# Altium project RK3128_BETA_V03_20151231.PrjPcb (part 2 of 3)

## Sheet Option_PMIC_RK818.SchDoc
size 420 x 297 mm
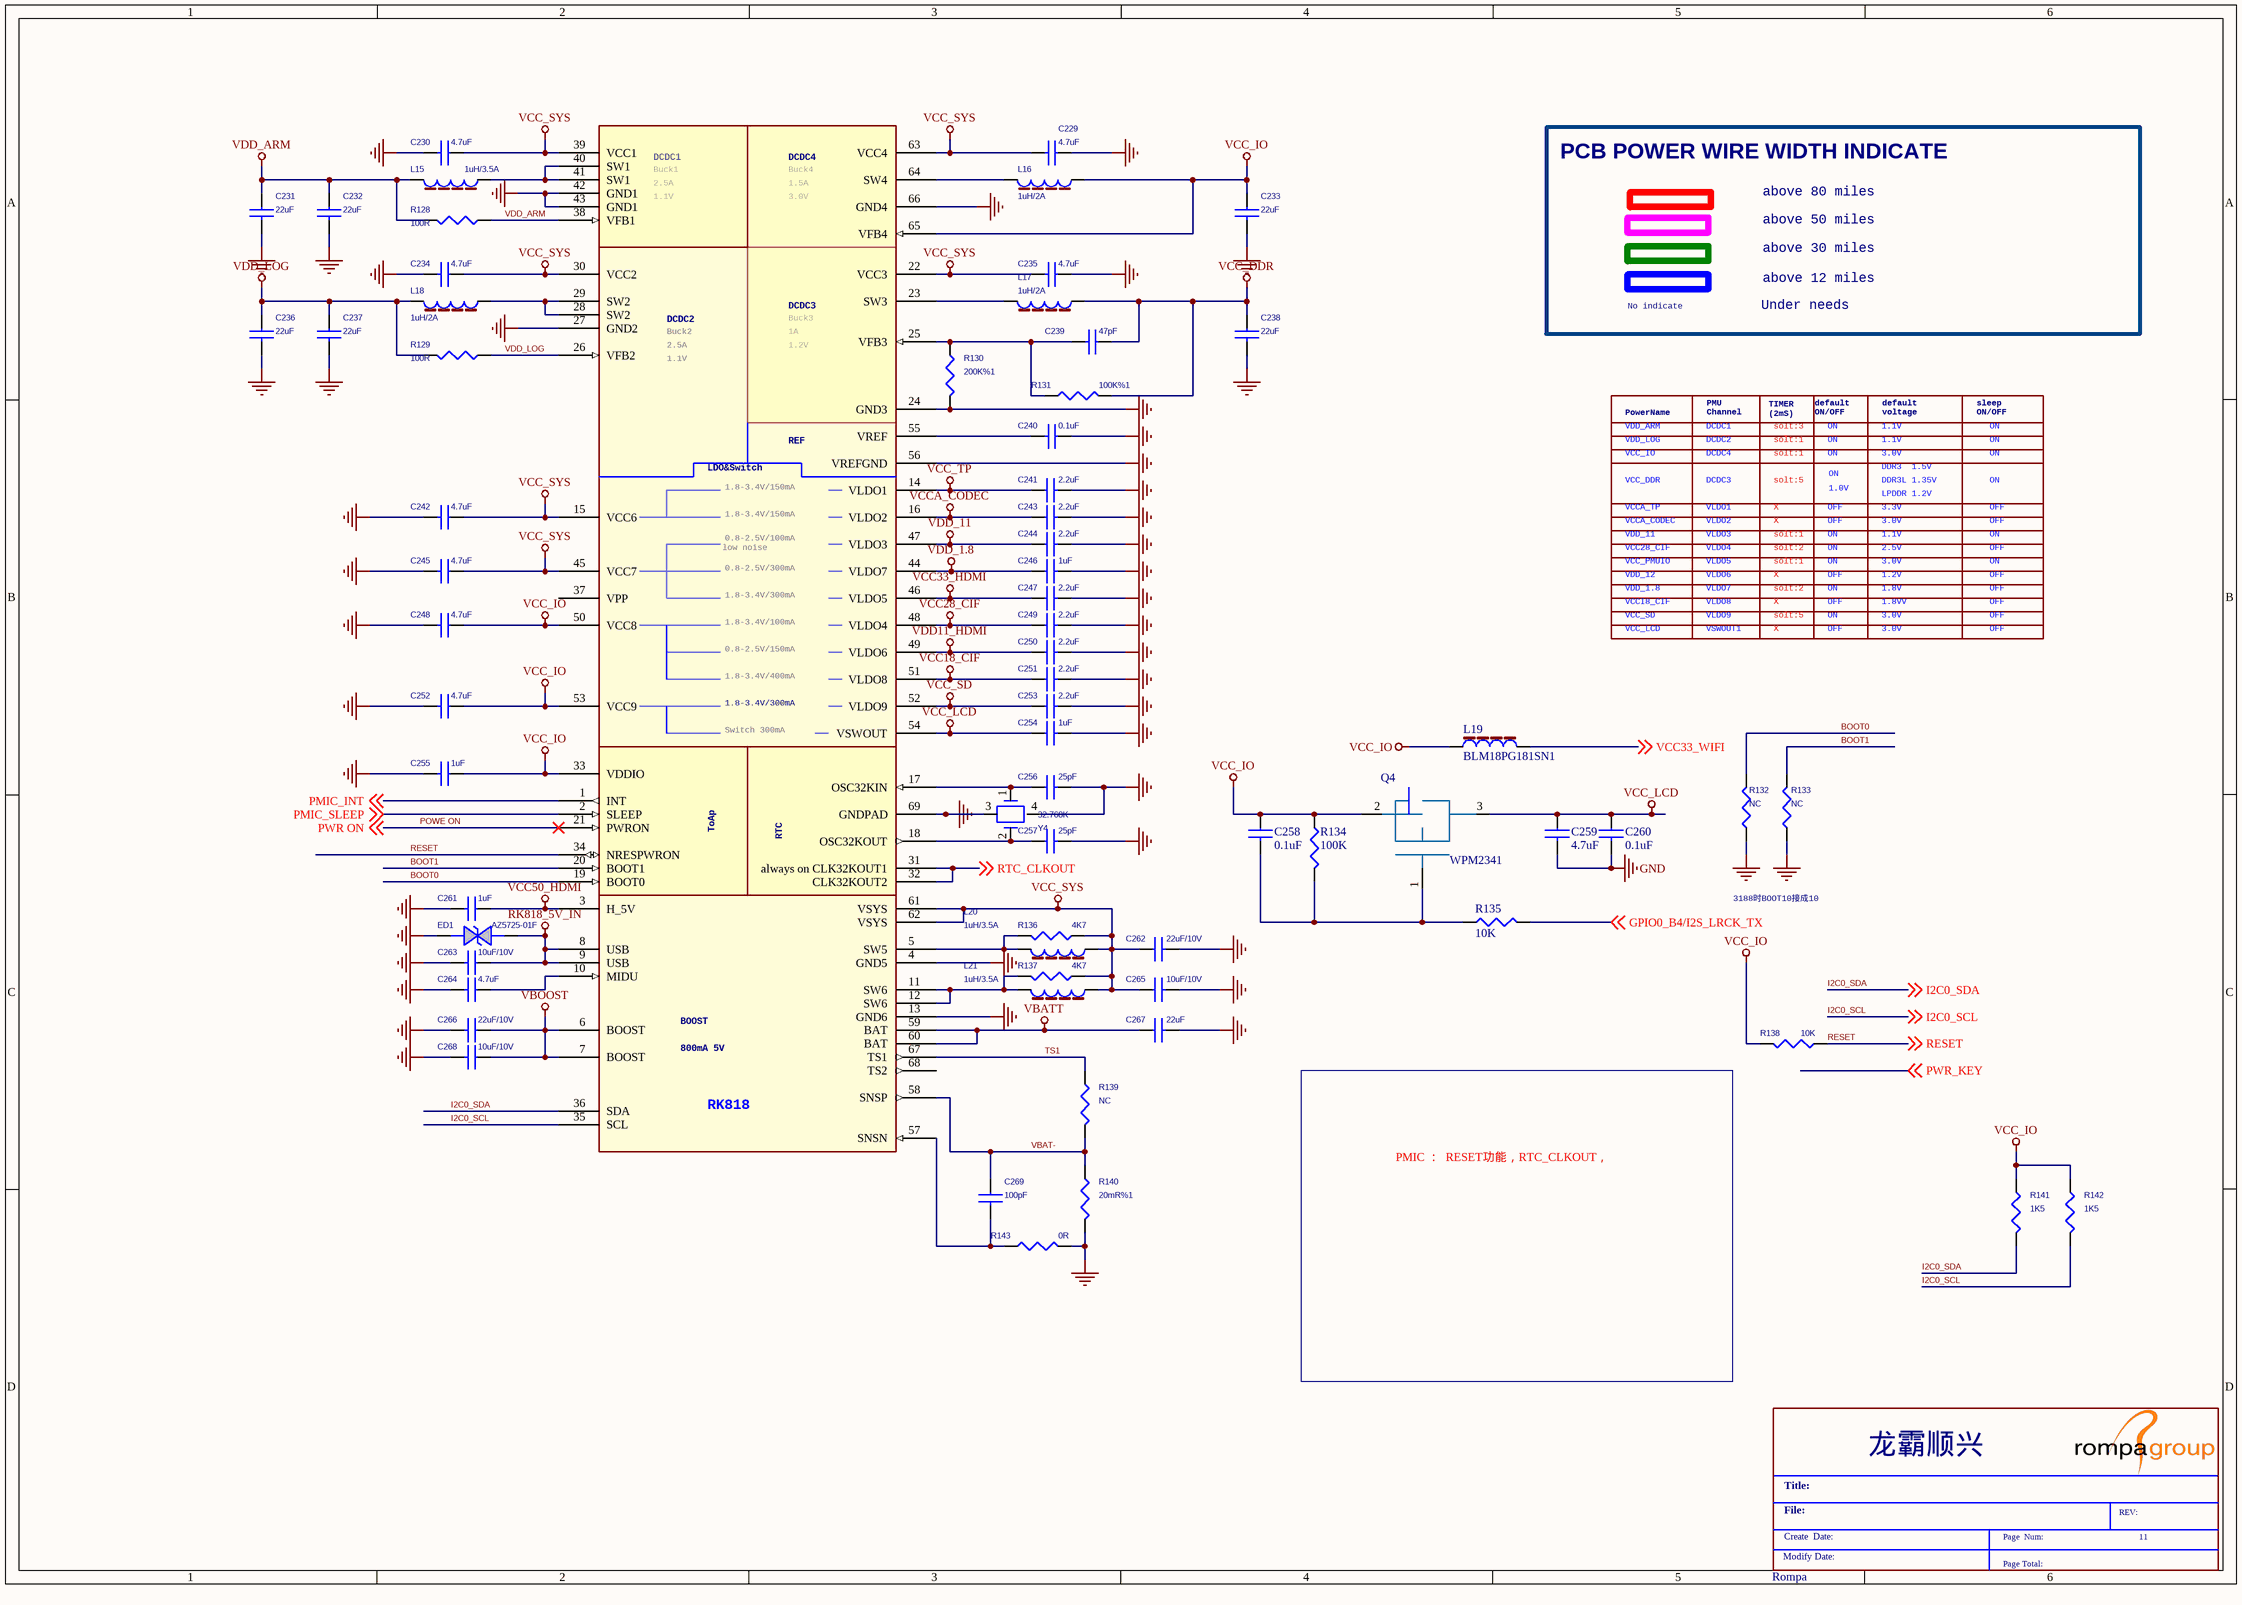
[diagram p15: Option_PMIC_RK818.SchDoc]

### Parts
(Parts that share a designator on the sheet are numbered #1, #2 ... from top to bottom, then left to right.)
*#15  Rompa  Schematic Page Number: 11  (graphical)
C229  4.7uF  [C0603]
C230  4.7uF  [C0603]
C231  22uF  [C0805]
C232  22uF  [C0805]
C233  22uF  [C0805]
C234  4.7uF  [C0603]
C235  4.7uF  [C0603]
C236  22uF  [C0805]
C237  22uF  [C0805]
C238  22uF  [C0805]
C239  47pF  [C0402]
C240  0.1uF  [C0402]
C241  2.2uF  [C0402]
C242  4.7uF  [C0603]
C243  2.2uF  [C0402]
C244  2.2uF  [C0402]
C245  4.7uF  [C0603]
C246  1uF  [C0402]
C247  2.2uF  [C0402]
C248  4.7uF  [C0603]
C249  2.2uF  [C0402]
C250  2.2uF  [C0402]
C251  2.2uF  [C0402]
C252  4.7uF  [C0603]
C253  2.2uF  [C0402]
C254  1uF  [C0402]
C255  1uF  [C0402]
C256  25pF  [C0402]
C257  25pF  [C0402]
C258  0.1uF  [C0402]
C259  4.7uF  [C0402]
C260  0.1uF  [C0402]
C261  1uF  [C0402]
C262  22uF/10V  [C1206]
C263  10uF/10V  [C0805]
C264  4.7uF  [C0603]
C265  10uF/10V  [C0805]
C266  22uF/10V  [C1206]
C267  22uF  [C0805]
C268  10uF/10V  [C0805]
C269  100pF  [C0402]
ED1  AZ5725-01F  [E0402]
L15  1uH/3.5A  [IND-4X4]
L16  1uH/2A  [IND-3X3]
L17  1uH/2A  [IND-3X3]
L18  1uH/2A  [IND-3X3]
L19  BLM18PG181SN1  [L0603]
L20  1uH/3.5A  [IND-4X4]
L21  1uH/3.5A  [IND-4X4]
Q4  WPM2341  [SOT23]
R128  100R  [R0402]
R129  100R  [R0402]
R130  200K%1  [R0402]
R131  100K%1  [R0402]
R132  NC  [R0402]
R133  NC  [R0402]
R134  100K  [R0402]
R135  10K  [R0402]
R136  4K7  [R0402]
R137  4K7  [R0402]
R138  10K  [R0402]
R139  NC  [R0402]
R140  20mR%1  [R1210]
R141  1K5  [R0402]
R142  1K5  [R0402]
R143  0R  [R0402]
U19  RK818  [QFN68]  (value not drawn)
Y4  32.768K  [CRY_MC146]

### Nets
GND: C229.1 C230.2 C231.2 C232.2 C233.2 C234.2 C235.1 C236.2 C237.2 C238.2 C240.1 C241.2 C242.2 C243.2 C244.2 C245.2 C246.2 C247.2 C248.2 C249.2 C250.2 C251.2 C252.2 C253.2 C254.2 C255.2 C256.2 C257.2 C259.2 C260.2 C261.2 C262.2 C263.2 C264.2 C265.2 C266.2 C267.2 C268.2 ED1.1 R130.1 R132.2 R133.2 R140.2 R143.2 U19.4(GND5) U19.13(GND6) U19.24(GND3) U19.27(GND2) U19.42(GND1) U19.43(GND1) U19.56(VREFGND) U19.66(GND4) U19.69(GNDPAD) Y4.3 Y4.4
RK818_5V_IN: C263.1 ED1.2 U19.8(USB) U19.9(USB)
VBATT: C267.1 U19.59(BAT) U19.60(BAT)
VBOOST: C266.1 C268.1 U19.6(BOOST) U19.7(BOOST)
VCC18_CIF: C251.1 U19.51(VLDO8)
VCC28_CIF: C249.1 U19.48(VLDO4)
VCC33_HDMI: C247.1 U19.46(VLDO5)
VCC50_HDMI: C261.1 U19.3(H_5V)
VCC_DDR: C238.1 C239.1 L17.2 R131.1
VCC_IO: C233.1 C248.1 C252.1 C255.1 C258.1 L16.2 L19.1 R134.1 R138.1 R141.1 R142.1 U19.33(VDDIO) U19.50(VCC8) U19.53(VCC9) U19.65(VFB4)
VCC_LCD: C254.1 C259.1 C260.1 U19.54(VSWOUT)
VCC_SD: C253.1 U19.52(VLDO9)
VCC_SYS: C229.2 C230.1 C234.1 C235.2 C242.1 C245.1 C262.1 C265.1 L20.2 L21.2 R136.1 R137.1 U19.15(VCC6) U19.22(VCC3) U19.30(VCC2) U19.39(VCC1) U19.45(VCC7) U19.61(VSYS) U19.62(VSYS) U19.63(VCC4)
VCC_TP: C241.1 U19.14(VLDO1)
VCCA_CODEC: C243.1 U19.16(VLDO2)
VDD11_HDMI: C250.1 U19.49(VLDO6)
VDD_1.8: C246.1 U19.44(VLDO7)
VDD_11: C244.1 U19.47(VLDO3)
VDD_ARM: C231.1 C232.1 L15.1 R128.1 R128.2 U19.38(VFB1)
VDD_LOG: C236.1 C237.1 L18.1 R129.1 R129.2 U19.26(VFB2)
BOOT0: R132.1 U19.19(BOOT0)
BOOT1: R133.1 U19.20(BOOT1)
GPIO0_B4/I2S_LRCK_TX: R135.2 ; off-sheet GPIO0_B4/I2S_LRCK_TX
I2C0_SCL: R142.2 U19.35(SCL) ; off-sheet I2C0_SCL
I2C0_SDA: R141.2 U19.36(SDA) ; off-sheet I2C0_SDA
PMIC_INT: U19.1(INT) ; off-sheet PMIC_INT
PMIC_SLEEP: U19.2(SLEEP) ; off-sheet PMIC_SLEEP
POWE ON: U19.21(PWRON) ; off-sheet PWR ON  [also labelled PWR ON]
RESET: R138.2 U19.34(NRESPWRON) ; off-sheet RESET
RTC_CLKOUT: U19.31(always_on_CLK32KOUT1) U19.32(CLK32KOUT2) ; off-sheet RTC_CLKOUT
TS1: R139.1 U19.67(TS1)
VBAT-: C269.1 R139.2 R140.1 U19.58(SNSP)
VCC33_WIFI: L19.2 ; off-sheet VCC33_WIFI  [project net VCCIO_WL]
NetC239_2: C239.2 R130.2 R131.2 U19.25(VFB3)
NetC240_2: C240.2 U19.55(VREF)
NetC256_1: C256.1 U19.17(OSC32KIN) Y4.1
NetC257_1: C257.1 U19.18(OSC32KOUT) Y4.2
NetC258_2: C258.2 Q4.1 R134.2 R135.1
NetC264_1: C264.1 U19.10(MIDU)
NetC269_2: C269.2 R143.1 U19.57(SNSN)
NetL15_2: L15.2 U19.40(SW1) U19.41(SW1)
NetL16_1: L16.1 U19.64(SW4)
NetL17_1: L17.1 U19.23(SW3)
NetL18_2: L18.2 U19.28(SW2) U19.29(SW2)
NetL20_1: L20.1 R136.2 U19.5(SW5)
NetL21_1: L21.1 R137.2 U19.11(SW6) U19.12(SW6)

Not connected (* = marked no-connect by the designer): Q4 2 3; U19 37(VPP) 68(TS2)

### Notes on the sheet
- PCB POWER WIRE WIDTH INDICATE
- above 30 miles
- above 50 miles
- above 80 miles
- No indicate
- Under needs
- above 12 miles
- VDD_ARM
- VCC_IO
- VDD_LOG
- PowerName
- PMU
  Channel
- DCDC4
- DCDC1
- DCDC2
- TIMER
  (2mS)
- solt:1
- solt:3
- default
  ON/OFF
- ON
- 1.1V
- default
  voltage
- 3.0V
- sleep
  ON/OFF
- VCC_DDR
- VCCA_TP
- VCCA_CODEC
- DCDC3
- VLDO2
- VLDO1
- solt:5
- X
- OFF
- 1.0V
- 3.3V
- DDR3  1.5V
- LPDDR 1.2V
- DDR3L 1.35V
- VDD_11
- VCC_PMUIO
- VCC28_CIF
- VDD_12
- VDD_1.8
- VLDO4
- VLDO5
- VLDO3
- VLDO7
- VLDO6
- solt:2
- 1.2V
- 1.8V
- 2.5V
- VCC_SD
- VCC_LCD
- VCCI8_CIF
- VSWOUT1
- VLDO8
- VLDO9
- 1.8VV
- 3188时BOOT10接成10
- (near U19) RK818
- PMIC ：  RESET功能，RTC_CLKOUT，
- (in symbol RK818_1) DCDC1; DCDC4; Buck1; Buck4; 2.5A; 1.5A; 1.1V; 3.0V; DCDC3; Buck3; DCDC2; Buck2; 1A; 1.2V; REF; LDO&Switch; 1.8-3.4V/150mA; 0.8-2.5V/100mA; low noise; 0.8-2.5V/300mA; 1.8-3.4V/300mA; 1.8-3.4V/100mA; 0.8-2.5V/150mA; 1.8-3.4V/400mA; Switch 300mA; ToAp; RTC; 800mA 5V
- (in symbol Rompa) 龙霸顺兴; Title:; File:; REV:; Create  Date:; Page  Num:; Modify Date:; Page Total:

### Library data of the parts
C229-C257 C261-C269 = CAP NP_4
C258-C260 = CAP NP
ED1 = DIODE BI-DIR TRIG: ESD
L15-L18 L20 L21 = INDUCTOR_2: ROOM: USB+5V
L19 = INDUCTOR_2
R128-R133 R136-R138 = RESISTOR_1: RES,thick film,47KOhm,+/-5%,1/16W,SMD0402
R134 R135 = RESISTOR
R139 R143 = RESISTOR_1: 贴片电阻; ROOM: USB+5V; MARK: 2K
R140 = RESISTOR_1: 贴片电阻; MARK: 2K; ROOM: USB+5V
R141 R142 = RES 1B: ROHS CHIP RES 4.7K 1/16W 5%
U19 = RK818_1
Y4 = CRYSTAL_0: Crystal,32.768KHz,+/-30ppm,12pF,MC146,-10°C ~ +60   °C; Part Type: 晶体类\无源晶体

## Sheet 11_RK3128_CODEC_HDMI_DAC.SchDoc
size 420 x 297 mm
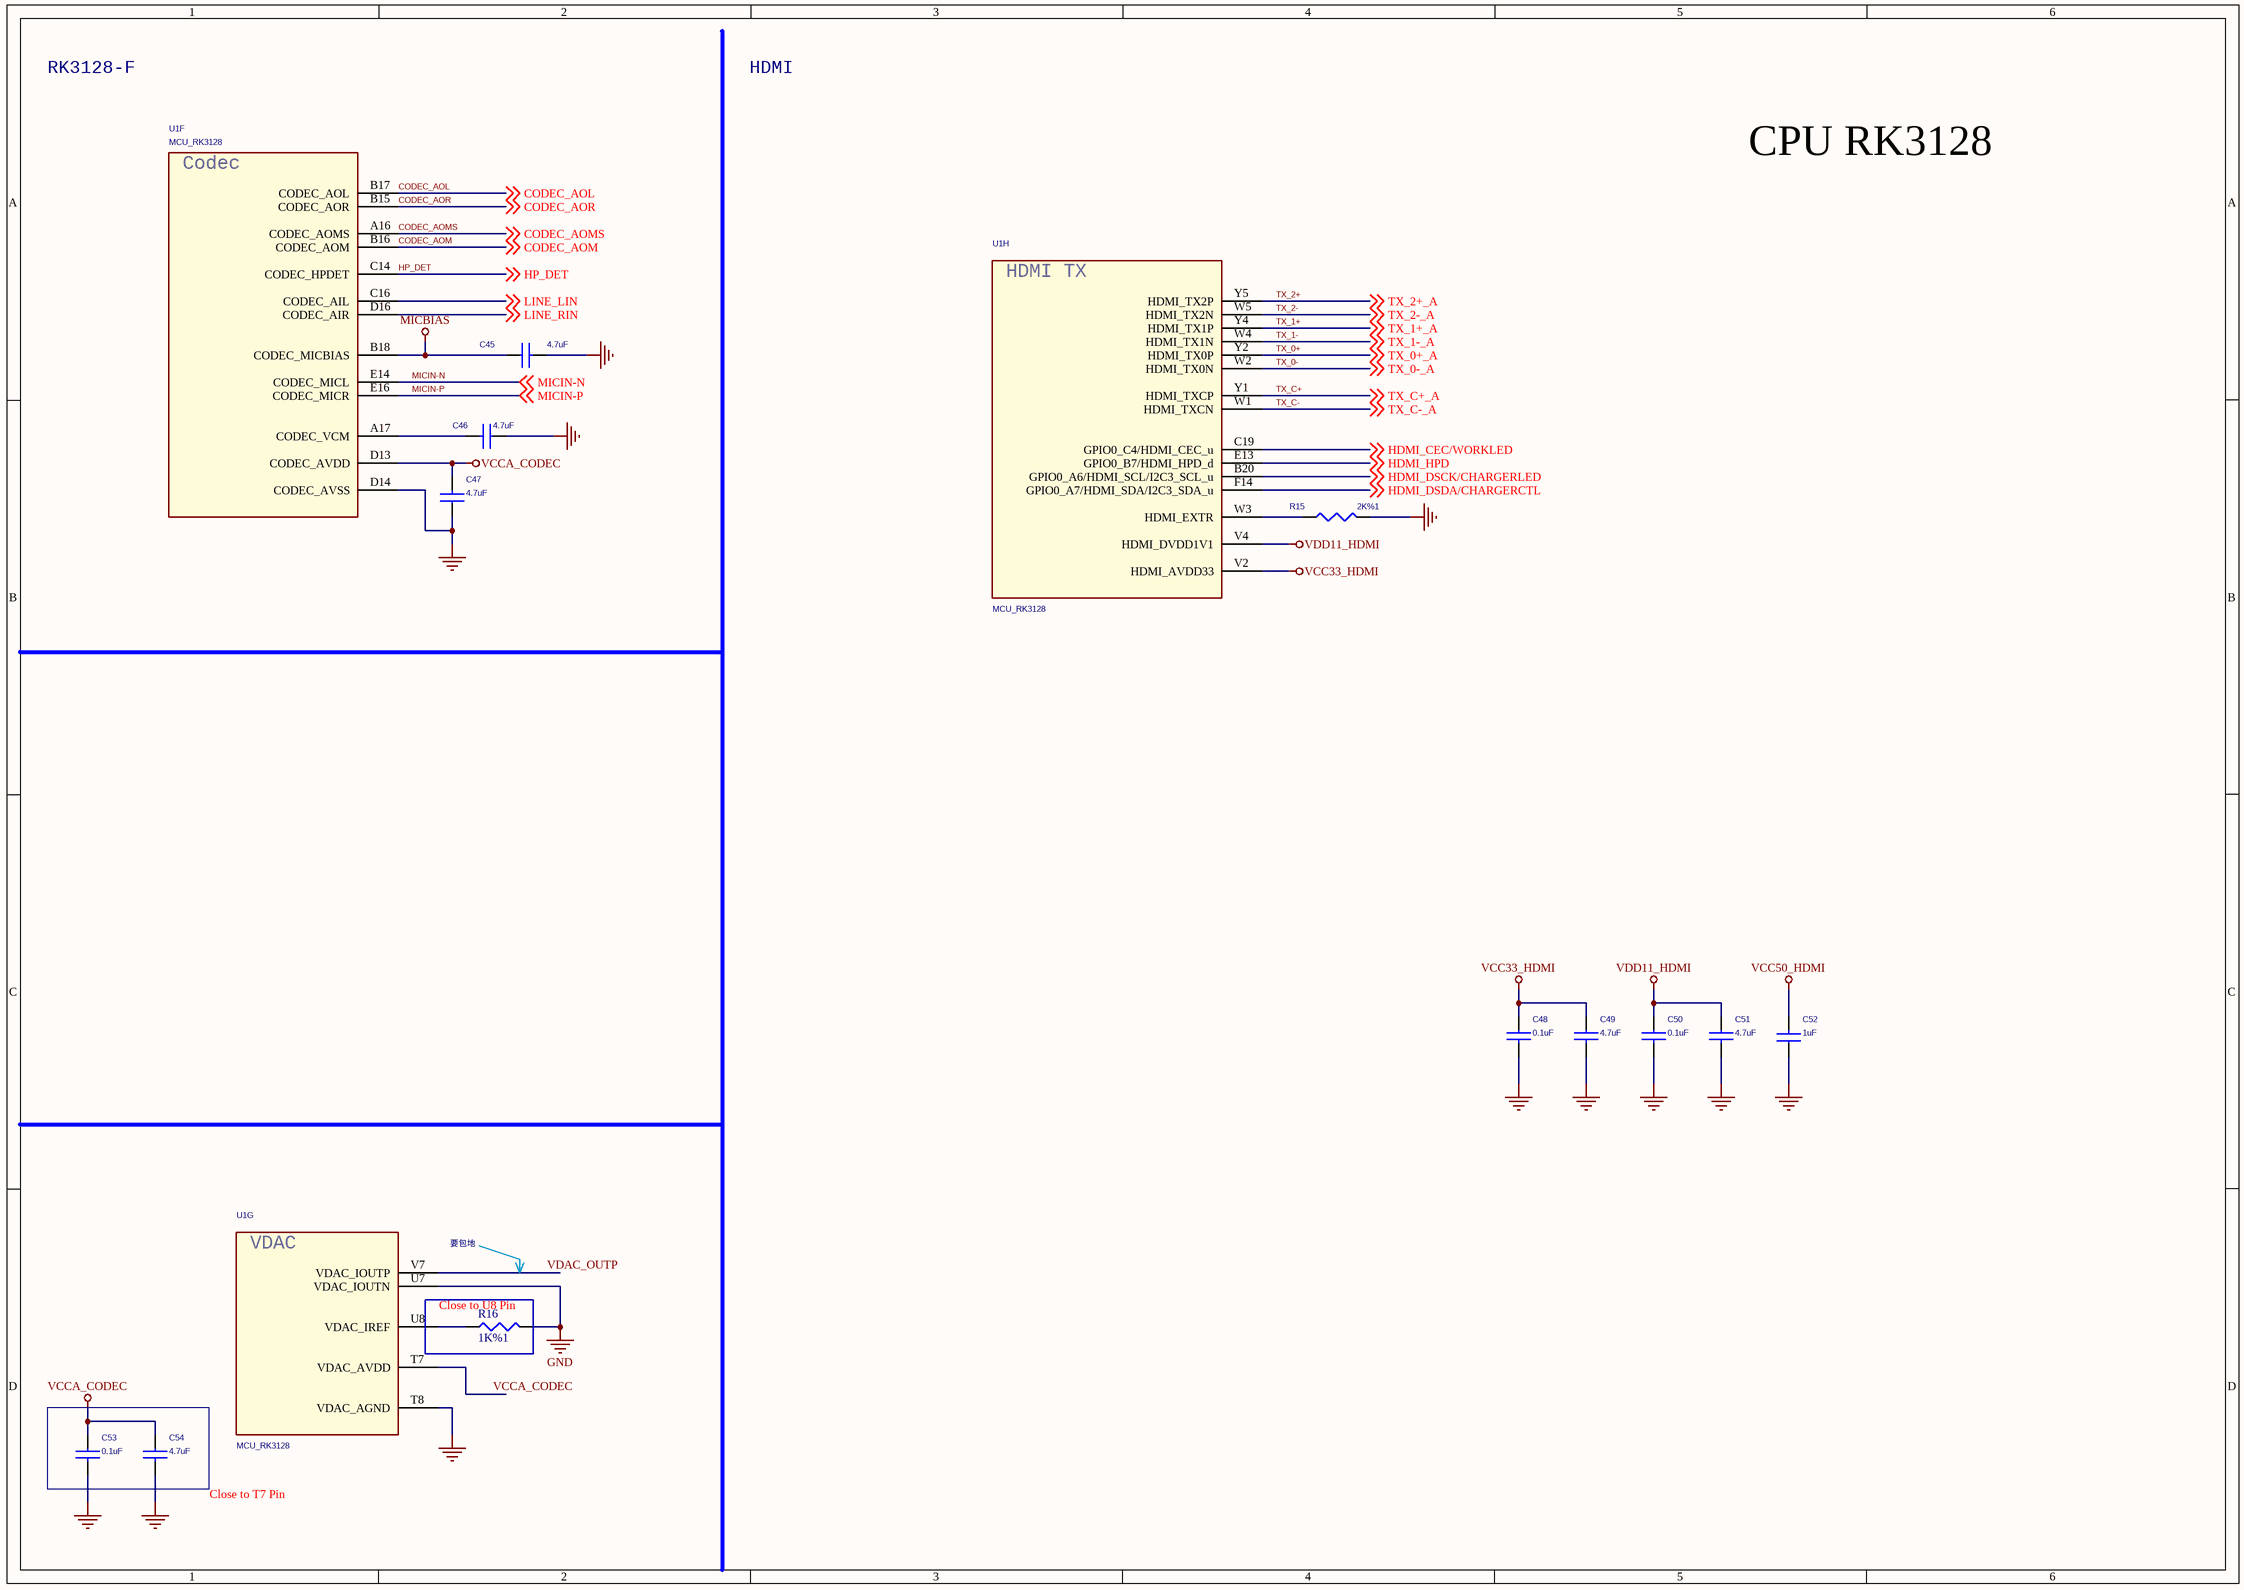
[diagram p16: 11_RK3128_CODEC_HDMI_DAC.SchDoc]

### Parts
C45  4.7uF  [C0603]
C46  4.7uF  [C0603]
C47  4.7uF  [C0603]
C48  0.1uF  [C0402]
C49  4.7uF  [C0603]
C50  0.1uF  [C0402]
C51  4.7uF  [C0603]
C52  1uF  [C0402]
C53  0.1uF  [C0402]
C54  4.7uF  [C0603]
R15  2K%1  [R0402]
R16  1K%1  [R0402]
U1  MCU_RK3128  [BGA316-14X14-0.65]  (parts F,G,H of 12)

### Blocks framed on the sheet
Close to U8 Pin: R16

### Nets
GND: C45.2 C46.1 C47.1 C48.2 C49.2 C50.2 C51.2 C52.1 C53.2 C54.2 R15.1 R16.2 U1.D14(CODEC_AVSS) U1.T8(VDAC_AGND) U1.U7(VDAC_IOUTN)
MICBIAS: C45.1 U1.B18(CODEC_MICBIAS)
VCC33_HDMI: C48.1 C49.1 U1.V2(HDMI_AVDD33)
VCC50_HDMI: C52.2
VCCA_CODEC: C47.2 C53.1 C54.1 U1.D13(CODEC_AVDD) U1.T7(VDAC_AVDD)
VDD11_HDMI: C50.1 C51.1 U1.V4(HDMI_DVDD1V1)
CODEC_AOL: U1.B17(CODEC_AOL) ; off-sheet CODEC_AOL
CODEC_AOM: U1.B16(CODEC_AOM) ; off-sheet CODEC_AOM
CODEC_AOMS: U1.A16(CODEC_AOMS) ; off-sheet CODEC_AOMS
CODEC_AOR: U1.B15(CODEC_AOR) ; off-sheet CODEC_AOR
HDMI_CEC/WORKLED: U1.C19(GPIO0_C4/HDMI_CEC_u) ; off-sheet HDMI_CEC/WORKLED
HDMI_DSCK/CHARGERLED: U1.B20(GPIO0_A6/HDMI_SCL/I2C3_SCL_u) ; off-sheet HDMI_DSCK/CHARGERLED
HDMI_DSDA/CHARGERCTL: U1.F14(GPIO0_A7/HDMI_SDA/I2C3_SDA_u) ; off-sheet HDMI_DSDA/CHARGERCTL
HDMI_HPD: U1.E13(GPIO0_B7/HDMI_HPD_d) ; off-sheet HDMI_HPD
HP_DET: U1.C14(CODEC_HPDET) ; off-sheet HP_DET
LINE_LIN: U1.C16(CODEC_AIL) ; off-sheet LINE_LIN
LINE_RIN: U1.D16(CODEC_AIR) ; off-sheet LINE_RIN
MICIN-N: U1.E14(CODEC_MICL) ; off-sheet MICIN-N
MICIN-P: U1.E16(CODEC_MICR) ; off-sheet MICIN-P
TX_0+: U1.Y2(HDMI_TX0P) ; off-sheet TX_0+_A  [also labelled TX_0+_A]
TX_0-: U1.W2(HDMI_TX0N) ; off-sheet TX_0-_A  [also labelled TX_0-_A]
TX_1+: U1.Y4(HDMI_TX1P) ; off-sheet TX_1+_A  [also labelled TX_1+_A]
TX_1-: U1.W4(HDMI_TX1N) ; off-sheet TX_1-_A  [also labelled TX_1-_A]
TX_2+: U1.Y5(HDMI_TX2P) ; off-sheet TX_2+_A  [also labelled TX_2+_A]
TX_2-: U1.W5(HDMI_TX2N) ; off-sheet TX_2-_A  [also labelled TX_2-_A]
TX_C+: U1.Y1(HDMI_TXCP) ; off-sheet TX_C+_A  [also labelled TX_C+_A]
TX_C-: U1.W1(HDMI_TXCN) ; off-sheet TX_C-_A  [also labelled TX_C-_A]
VDAC_OUTP: U1.V7(VDAC_IOUTP)
NetC46_2: C46.2 U1.A17(CODEC_VCM)
NetR15_2: R15.2 U1.W3(HDMI_EXTR)
NetR16_1: R16.1 U1.U8(VDAC_IREF)

### Notes on the sheet
- RK3128-F
- HDMI
- CPU RK3128
- 要包地
- Close to T7 Pin
- (in symbol MCU_RK3128, part F) Codec
- (in symbol MCU_RK3128, part G) VDAC
- (in symbol MCU_RK3128, part H) HDMI TX

### Library data of the parts
C45 C48-C51 C53 C54 = CAP NP
C46 = CAP NP: CAP,MLCC,10uF,+/-10%,X5R,16V,SMD0805
C47 = CAP NP: RoHS CHIP CAP 0.1uF +10/-10% X7R
C52 = CAP NP: RoHS CHIP CAP 1uF +10/-10% X5R
R15 = RESISTOR_0: RES,thick film,3.5KOhm,+/-5%,1/16W,SMD0402
R16 = RESISTOR: 1K %1 R0402

## Sheet 10_RK3128_misc.SchDoc
size 297 x 209 mm
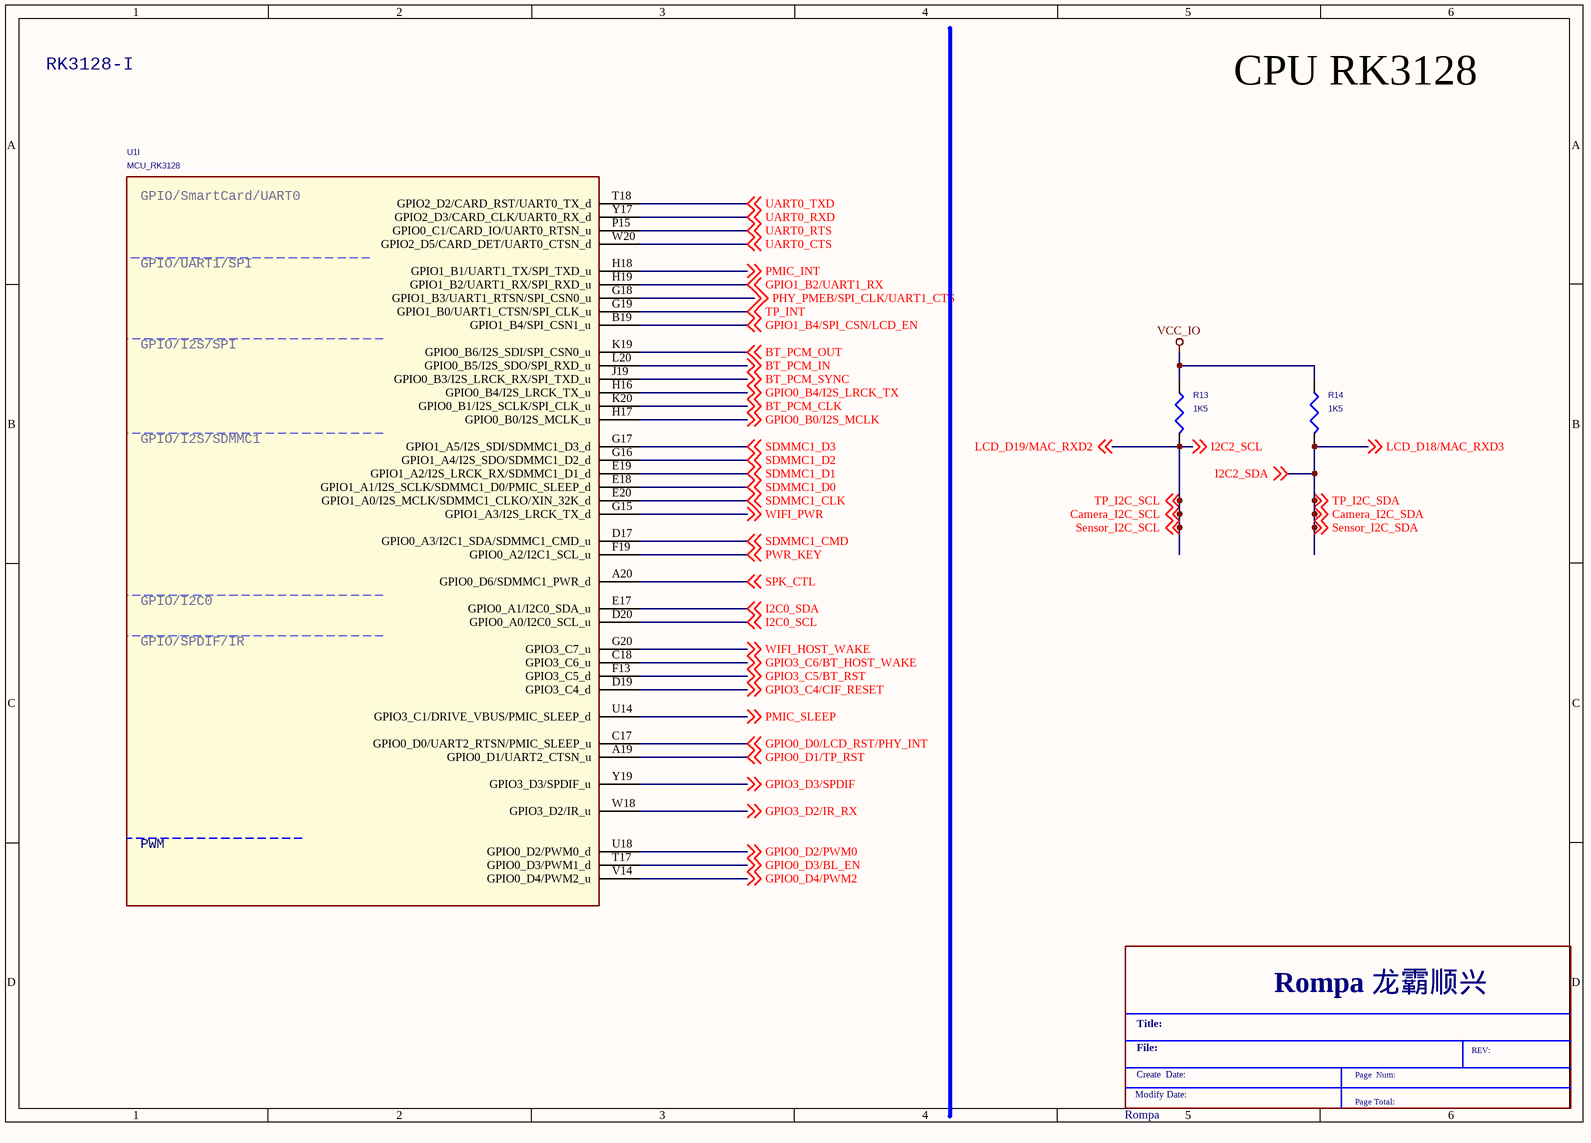
[diagram p17: 10_RK3128_misc.SchDoc]

### Parts
(Parts that share a designator on the sheet are numbered #1, #2 ... from top to bottom, then left to right.)
*#16  Rompa  (graphical)
R13  1K5  [R0402]
R14  1K5  [R0402]
U1  MCU_RK3128  [BGA316-14X14-0.65]  (part I of 12)

### Nets
VCC_IO: R13.1 R14.1
BT_PCM_CLK: U1.K20(GPIO0_B1/I2S_SCLK/SPI_CLK_u) ; off-sheet BT_PCM_CLK
BT_PCM_IN: U1.L20(GPIO0_B5/I2S_SDO/SPI_RXD_u) ; off-sheet BT_PCM_IN
BT_PCM_OUT: U1.K19(GPIO0_B6/I2S_SDI/SPI_CSN0_u) ; off-sheet BT_PCM_OUT
BT_PCM_SYNC: U1.J19(GPIO0_B3/I2S_LRCK_RX/SPI_TXD_u) ; off-sheet BT_PCM_SYNC
Camera_I2C_SCL: R13.2 R14.2 ; off-sheet LCD_D19/MAC_RXD2, off-sheet LCD_D18/MAC_RXD3, off-sheet I2C2_SCL, off-sheet I2C2_SDA, off-sheet TP_I2C_SDA, off-sheet TP_I2C_SCL, off-sheet Camera_I2C_SDA, off-sheet Camera_I2C_SCL, off-sheet Sensor_I2C_SDA, off-sheet Sensor_I2C_SCL  [also labelled Camera_I2C_SDA, I2C2_SCL, I2C2_SDA, LCD_D18/MAC_RXD3, LCD_D19/MAC_RXD2, Sensor_I2C_SCL, Sensor_I2C_SDA, TP_I2C_SCL, TP_I2C_SDA]
GPIO0_B0/I2S_MCLK: U1.H17(GPIO0_B0/I2S_MCLK_u) ; off-sheet GPIO0_B0/I2S_MCLK
GPIO0_B4/I2S_LRCK_TX: U1.H16(GPIO0_B4/I2S_LRCK_TX_u) ; off-sheet GPIO0_B4/I2S_LRCK_TX
GPIO0_D0/LCD_RST/PHY_INT: U1.C17(GPIO0_D0/UART2_RTSN/PMIC_SLEEP_u) ; off-sheet GPIO0_D0/LCD_RST/PHY_INT
GPIO0_D1/TP_RST: U1.A19(GPIO0_D1/UART2_CTSN_u) ; off-sheet GPIO0_D1/TP_RST
GPIO0_D2/PWM0: U1.U18(GPIO0_D2/PWM0_d) ; off-sheet GPIO0_D2/PWM0  [project net LCDC_BL]
GPIO0_D3/BL_EN: U1.T17(GPIO0_D3/PWM1_d) ; off-sheet GPIO0_D3/BL_EN
GPIO0_D4/PWM2: U1.V14(GPIO0_D4/PWM2_u) ; off-sheet GPIO0_D4/PWM2
GPIO1_B2/UART1_RX: U1.H19(GPIO1_B2/UART1_RX/SPI_RXD_u) ; off-sheet GPIO1_B2/UART1_RX
GPIO1_B4/SPI_CSN/LCD_EN: U1.B19(GPIO1_B4/SPI_CSN1_u) ; off-sheet GPIO1_B4/SPI_CSN/LCD_EN
GPIO3_C4/CIF_RESET: U1.D19(GPIO3_C4_d) ; off-sheet GPIO3_C4/CIF_RESET
GPIO3_C5/BT_RST: U1.F13(GPIO3_C5_d) ; off-sheet GPIO3_C5/BT_RST
GPIO3_C6/BT_HOST_WAKE: U1.C18(GPIO3_C6_u) ; off-sheet GPIO3_C6/BT_HOST_WAKE
GPIO3_D2/IR_RX: U1.W18(GPIO3_D2/IR_u) ; off-sheet GPIO3_D2/IR_RX
GPIO3_D3/SPDIF: U1.Y19(GPIO3_D3/SPDIF_u) ; off-sheet GPIO3_D3/SPDIF
I2C0_SCL: U1.D20(GPIO0_A0/I2C0_SCL_u) ; off-sheet I2C0_SCL
I2C0_SDA: U1.E17(GPIO0_A1/I2C0_SDA_u) ; off-sheet I2C0_SDA
PHY_PMEB/SPI_CLK/UART1_CTS: U1.G18(GPIO1_B3/UART1_RTSN/SPI_CSN0_u) ; off-sheet PHY_PMEB/SPI_CLK/UART1_CTS
PMIC_INT: U1.H18(GPIO1_B1/UART1_TX/SPI_TXD_u) ; off-sheet PMIC_INT
PMIC_SLEEP: U1.U14(GPIO3_C1/DRIVE_VBUS/PMIC_SLEEP_d) ; off-sheet PMIC_SLEEP
PWR_KEY: U1.F19(GPIO0_A2/I2C1_SCL_u) ; off-sheet PWR_KEY
SDMMC1_CLK: U1.E20(GPIO1_A0/I2S_MCLK/SDMMC1_CLKO/XIN_32K_d) ; off-sheet SDMMC1_CLK
SDMMC1_CMD: U1.D17(GPIO0_A3/I2C1_SDA/SDMMC1_CMD_u) ; off-sheet SDMMC1_CMD
SDMMC1_D0: U1.E18(GPIO1_A1/I2S_SCLK/SDMMC1_D0/PMIC_SLEEP_d) ; off-sheet SDMMC1_D0
SDMMC1_D1: U1.E19(GPIO1_A2/I2S_LRCK_RX/SDMMC1_D1_d) ; off-sheet SDMMC1_D1
SDMMC1_D2: U1.G16(GPIO1_A4/I2S_SDO/SDMMC1_D2_d) ; off-sheet SDMMC1_D2
SDMMC1_D3: U1.G17(GPIO1_A5/I2S_SDI/SDMMC1_D3_d) ; off-sheet SDMMC1_D3
SPK_CTL: U1.A20(GPIO0_D6/SDMMC1_PWR_d) ; off-sheet SPK_CTL
TP_INT: U1.G19(GPIO1_B0/UART1_CTSN/SPI_CLK_u) ; off-sheet TP_INT
UART0_CTS: U1.W20(GPIO2_D5/CARD_DET/UART0_CTSN_d) ; off-sheet UART0_CTS
UART0_RTS: U1.P15(GPIO0_C1/CARD_IO/UART0_RTSN_u) ; off-sheet UART0_RTS
UART0_RXD: U1.Y17(GPIO2_D3/CARD_CLK/UART0_RX_d) ; off-sheet UART0_RXD
UART0_TXD: U1.T18(GPIO2_D2/CARD_RST/UART0_TX_d) ; off-sheet UART0_TXD
WIFI_HOST_WAKE: U1.G20(GPIO3_C7_u) ; off-sheet WIFI_HOST_WAKE
WIFI_PWR: U1.G15(GPIO1_A3/I2S_LRCK_TX_d) ; off-sheet WIFI_PWR

### Notes on the sheet
- RK3128-I
- CPU RK3128
- (in symbol MCU_RK3128, part I) GPIO/SmartCard/UART0; GPIO/UART1/SPI; GPIO/I2S/SPI; GPIO/I2S/SDMMC1; GPIO/I2C0; GPIO/SPDIF/IR; PWM
- (in symbol Rompa) Rompa 龙霸顺兴; Title:; File:; REV:; Create  Date:; Page  Num:; Modify Date:; Page Total:

### Library data of the parts
R13 R14 = RES 1B: ROHS CHIP RES 4.7K 1/16W 5%

## Sheet 09_Rk3128_lcd_cif.SchDoc
size 297 x 209 mm
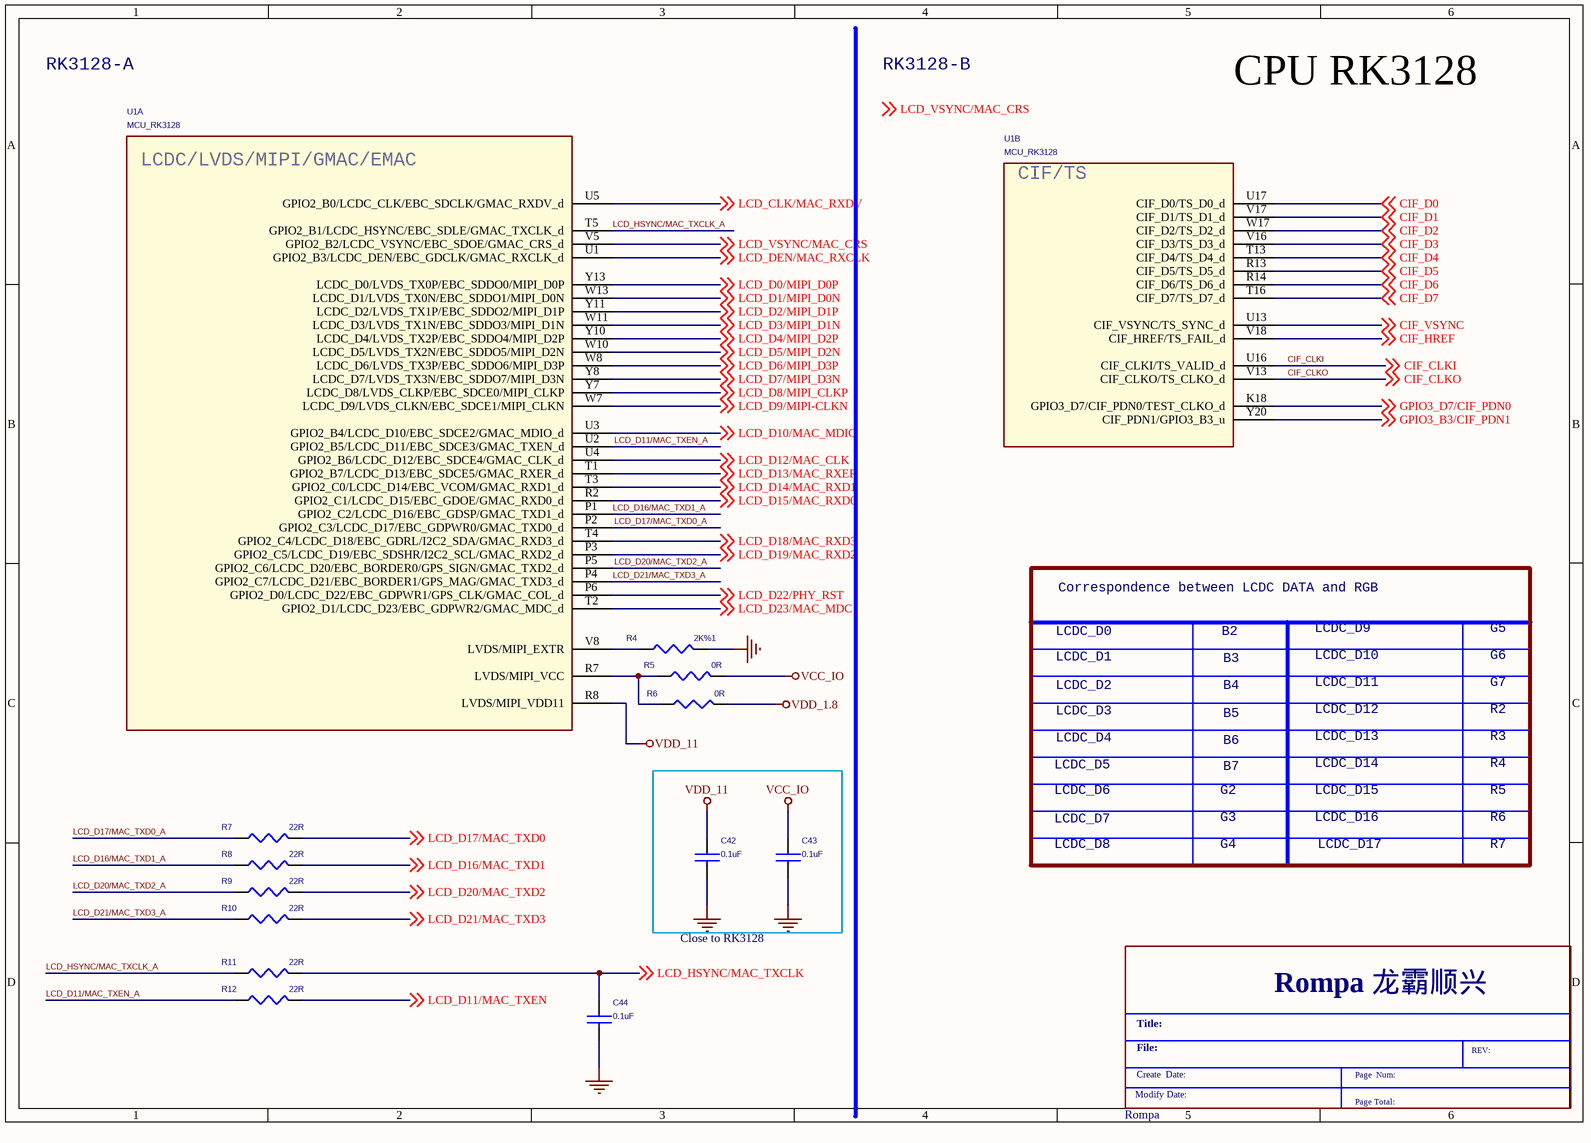
[diagram p18: 09_Rk3128_lcd_cif.SchDoc]

### Parts
(Parts that share a designator on the sheet are numbered #1, #2 ... from top to bottom, then left to right.)
*#17  Rompa  (graphical)
C42  0.1uF  [C0402]
C43  0.1uF  [C0402]
C44  0.1uF  [C0402]
R4  2K%1  [R0402]
R5  0R  [R0402]
R6  0R  [R0402]
R7  22R  [R0402]
R8  22R  [R0402]
R9  22R  [R0402]
R10  22R  [R0402]
R11  22R  [R0402]
R12  22R  [R0402]
U1  MCU_RK3128  [BGA316-14X14-0.65]  (parts A,B of 12)

### Nets
GND: C42.2 C43.2 C44.2 R4.2
VCC_IO: C43.1 R5.2
VDD_1.8: R6.2
VDD_11: C42.1 U1.R8(LVDS/MIPI_VDD11)
CIF_CLKI: U1.U16(CIF_CLKI/TS_VALID_d) ; off-sheet CIF_CLKI
CIF_CLKO: U1.V13(CIF_CLKO/TS_CLKO_d) ; off-sheet CIF_CLKO
CIF_D0: U1.U17(CIF_D0/TS_D0_d) ; off-sheet CIF_D0
CIF_D1: U1.V17(CIF_D1/TS_D1_d) ; off-sheet CIF_D1
CIF_D2: U1.W17(CIF_D2/TS_D2_d) ; off-sheet CIF_D2
CIF_D3: U1.V16(CIF_D3/TS_D3_d) ; off-sheet CIF_D3
CIF_D4: U1.T13(CIF_D4/TS_D4_d) ; off-sheet CIF_D4
CIF_D5: U1.R13(CIF_D5/TS_D5_d) ; off-sheet CIF_D5
CIF_D6: U1.R14(CIF_D6/TS_D6_d) ; off-sheet CIF_D6
CIF_D7: U1.T16(CIF_D7/TS_D7_d) ; off-sheet CIF_D7
CIF_HREF: U1.V18(CIF_HREF/TS_FAIL_d) ; off-sheet CIF_HREF
CIF_VSYNC: U1.U13(CIF_VSYNC/TS_SYNC_d) ; off-sheet CIF_VSYNC
GPIO3_B3/CIF_PDN1: U1.Y20(CIF_PDN1/GPIO3_B3_u) ; off-sheet GPIO3_B3/CIF_PDN1
GPIO3_D7/CIF_PDN0: U1.K18(GPIO3_D7/CIF_PDN0/TEST_CLKO_d) ; off-sheet GPIO3_D7/CIF_PDN0
LCD_CLK/MAC_RXDV: U1.U5(GPIO2_B0/LCDC_CLK/EBC_SDCLK/GMAC_RXDV_d) ; off-sheet LCD_CLK/MAC_RXDV
LCD_D0/MIPI_D0P: U1.Y13(LCDC_D0/LVDS_TX0P/EBC_SDDO0/MIPI_D0P) ; off-sheet LCD_D0/MIPI_D0P
LCD_D1/MIPI_D0N: U1.W13(LCDC_D1/LVDS_TX0N/EBC_SDDO1/MIPI_D0N) ; off-sheet LCD_D1/MIPI_D0N
LCD_D2/MIPI_D1P: U1.Y11(LCDC_D2/LVDS_TX1P/EBC_SDDO2/MIPI_D1P) ; off-sheet LCD_D2/MIPI_D1P
LCD_D3/MIPI_D1N: U1.W11(LCDC_D3/LVDS_TX1N/EBC_SDDO3/MIPI_D1N) ; off-sheet LCD_D3/MIPI_D1N
LCD_D4/MIPI_D2P: U1.Y10(LCDC_D4/LVDS_TX2P/EBC_SDDO4/MIPI_D2P) ; off-sheet LCD_D4/MIPI_D2P
LCD_D5/MIPI_D2N: U1.W10(LCDC_D5/LVDS_TX2N/EBC_SDDO5/MIPI_D2N) ; off-sheet LCD_D5/MIPI_D2N
LCD_D6/MIPI_D3P: U1.W8(LCDC_D6/LVDS_TX3P/EBC_SDDO6/MIPI_D3P) ; off-sheet LCD_D6/MIPI_D3P
LCD_D7/MIPI_D3N: U1.Y8(LCDC_D7/LVDS_TX3N/EBC_SDDO7/MIPI_D3N) ; off-sheet LCD_D7/MIPI_D3N
LCD_D8/MIPI_CLKP: U1.Y7(LCDC_D8/LVDS_CLKP/EBC_SDCE0/MIPI_CLKP) ; off-sheet LCD_D8/MIPI_CLKP
LCD_D9/MIPI-CLKN: U1.W7(LCDC_D9/LVDS_CLKN/EBC_SDCE1/MIPI_CLKN) ; off-sheet LCD_D9/MIPI-CLKN
LCD_D10/MAC_MDIO: U1.U3(GPIO2_B4/LCDC_D10/EBC_SDCE2/GMAC_MDIO_d) ; off-sheet LCD_D10/MAC_MDIO
LCD_D11/MAC_TXEN: R12.2 ; off-sheet LCD_D11/MAC_TXEN
LCD_D11/MAC_TXEN_A: R12.1 U1.U2(GPIO2_B5/LCDC_D11/EBC_SDCE3/GMAC_TXEN_d)
LCD_D12/MAC_CLK: U1.U4(GPIO2_B6/LCDC_D12/EBC_SDCE4/GMAC_CLK_d) ; off-sheet LCD_D12/MAC_CLK
LCD_D13/MAC_RXER: U1.T1(GPIO2_B7/LCDC_D13/EBC_SDCE5/GMAC_RXER_d) ; off-sheet LCD_D13/MAC_RXER
LCD_D14/MAC_RXD1: U1.T3(GPIO2_C0/LCDC_D14/EBC_VCOM/GMAC_RXD1_d) ; off-sheet LCD_D14/MAC_RXD1
LCD_D15/MAC_RXD0: U1.R2(GPIO2_C1/LCDC_D15/EBC_GDOE/GMAC_RXD0_d) ; off-sheet LCD_D15/MAC_RXD0
LCD_D16/MAC_TXD1: R8.2 ; off-sheet LCD_D16/MAC_TXD1
LCD_D16/MAC_TXD1_A: R8.1 U1.P1(GPIO2_C2/LCDC_D16/EBC_GDSP/GMAC_TXD1_d)
LCD_D17/MAC_TXD0: R7.2 ; off-sheet LCD_D17/MAC_TXD0
LCD_D17/MAC_TXD0_A: R7.1 U1.P2(GPIO2_C3/LCDC_D17/EBC_GDPWR0/GMAC_TXD0_d)
LCD_D18/MAC_RXD3: U1.P3(GPIO2_C5/LCDC_D19/EBC_SDSHR/I2C2_SCL/GMAC_RXD2_d) U1.T4(GPIO2_C4/LCDC_D18/EBC_GDRL/I2C2_SDA/GMAC_RXD3_d) ; off-sheet LCD_D19/MAC_RXD2, off-sheet LCD_D18/MAC_RXD3  [also labelled LCD_D19/MAC_RXD2]  [project net Camera_I2C_SCL]
LCD_D20/MAC_TXD2: R9.2 ; off-sheet LCD_D20/MAC_TXD2
LCD_D20/MAC_TXD2_A: R9.1 U1.P5(GPIO2_C6/LCDC_D20/EBC_BORDER0/GPS_SIGN/GMAC_TXD2_d)
LCD_D21/MAC_TXD3: R10.2 ; off-sheet LCD_D21/MAC_TXD3
LCD_D21/MAC_TXD3_A: R10.1 U1.P4(GPIO2_C7/LCDC_D21/EBC_BORDER1/GPS_MAG/GMAC_TXD3_d)
LCD_D22/PHY_RST: U1.P6(GPIO2_D0/LCDC_D22/EBC_GDPWR1/GPS_CLK/GMAC_COL_d) ; off-sheet LCD_D22/PHY_RST
LCD_D23/MAC_MDC: U1.T2(GPIO2_D1/LCDC_D23/EBC_GDPWR2/GMAC_MDC_d) ; off-sheet LCD_D23/MAC_MDC
LCD_DEN/MAC_RXCLK: U1.U1(GPIO2_B3/LCDC_DEN/EBC_GDCLK/GMAC_RXCLK_d) ; off-sheet LCD_DEN/MAC_RXCLK
LCD_HSYNC/MAC_TXCLK: C44.1 R11.2 ; off-sheet LCD_HSYNC/MAC_TXCLK  [project net HSYNC]
LCD_HSYNC/MAC_TXCLK_A: R11.1 U1.T5(GPIO2_B1/LCDC_HSYNC/EBC_SDLE/GMAC_TXCLK_d)
LCD_VSYNC/MAC_CRS: U1.V5(GPIO2_B2/LCDC_VSYNC/EBC_SDOE/GMAC_CRS_d) ; off-sheet LCD_VSYNC/MAC_CRS  [project net VSYNC]
NetR4_1: R4.1 U1.V8(LVDS/MIPI_EXTR)
NetR5_1: R5.1 R6.1 U1.R7(LVDS/MIPI_VCC)

### Notes on the sheet
- RK3128-A
- RK3128-B
- CPU RK3128
- Correspondence between LCDC DATA and RGB
- LCDC_D0
- LCDC_D1
- B2
- B3
- LCDC_D10
- LCDC_D9
- G5
- G6
- LCDC_D3
- LCDC_D4
- LCDC_D2
- B4
- B6
- B5
- LCDC_D13
- LCDC_D12
- LCDC_D11
- R3
- R2
- G7
- LCDC_D6
- LCDC_D5
- G2
- B7
- LCDC_D15
- LCDC_D14
- R5
- R4
- LCDC_D7
- LCDC_D8
- G3
- G4
- LCDC_D16
- LCDC_D17
- R7
- R6
- Close to RK3128
- Labels drawn without touching a wire or pin: LCD_VSYNC/MAC_CRS
- (in symbol MCU_RK3128, part A) LCDC/LVDS/MIPI/GMAC/EMAC
- (in symbol MCU_RK3128, part B) CIF/TS
- (in symbol Rompa) Rompa 龙霸顺兴; Title:; File:; REV:; Create  Date:; Page  Num:; Modify Date:; Page Total:

### Library data of the parts
C42-C44 = CAP NP: RoHS CHIP CAP 0.1uF +10/-10% X7R
R4 R5 R7-R12 = RES 1B: ROHS CHIP RES 4.7K 1/16W 5%
R6 = RES 1B: NC/ 0R; Descript: NC/0R

## Sheet 08_RK3128_Flash_SDMMC.SchDoc
size 297 x 209 mm
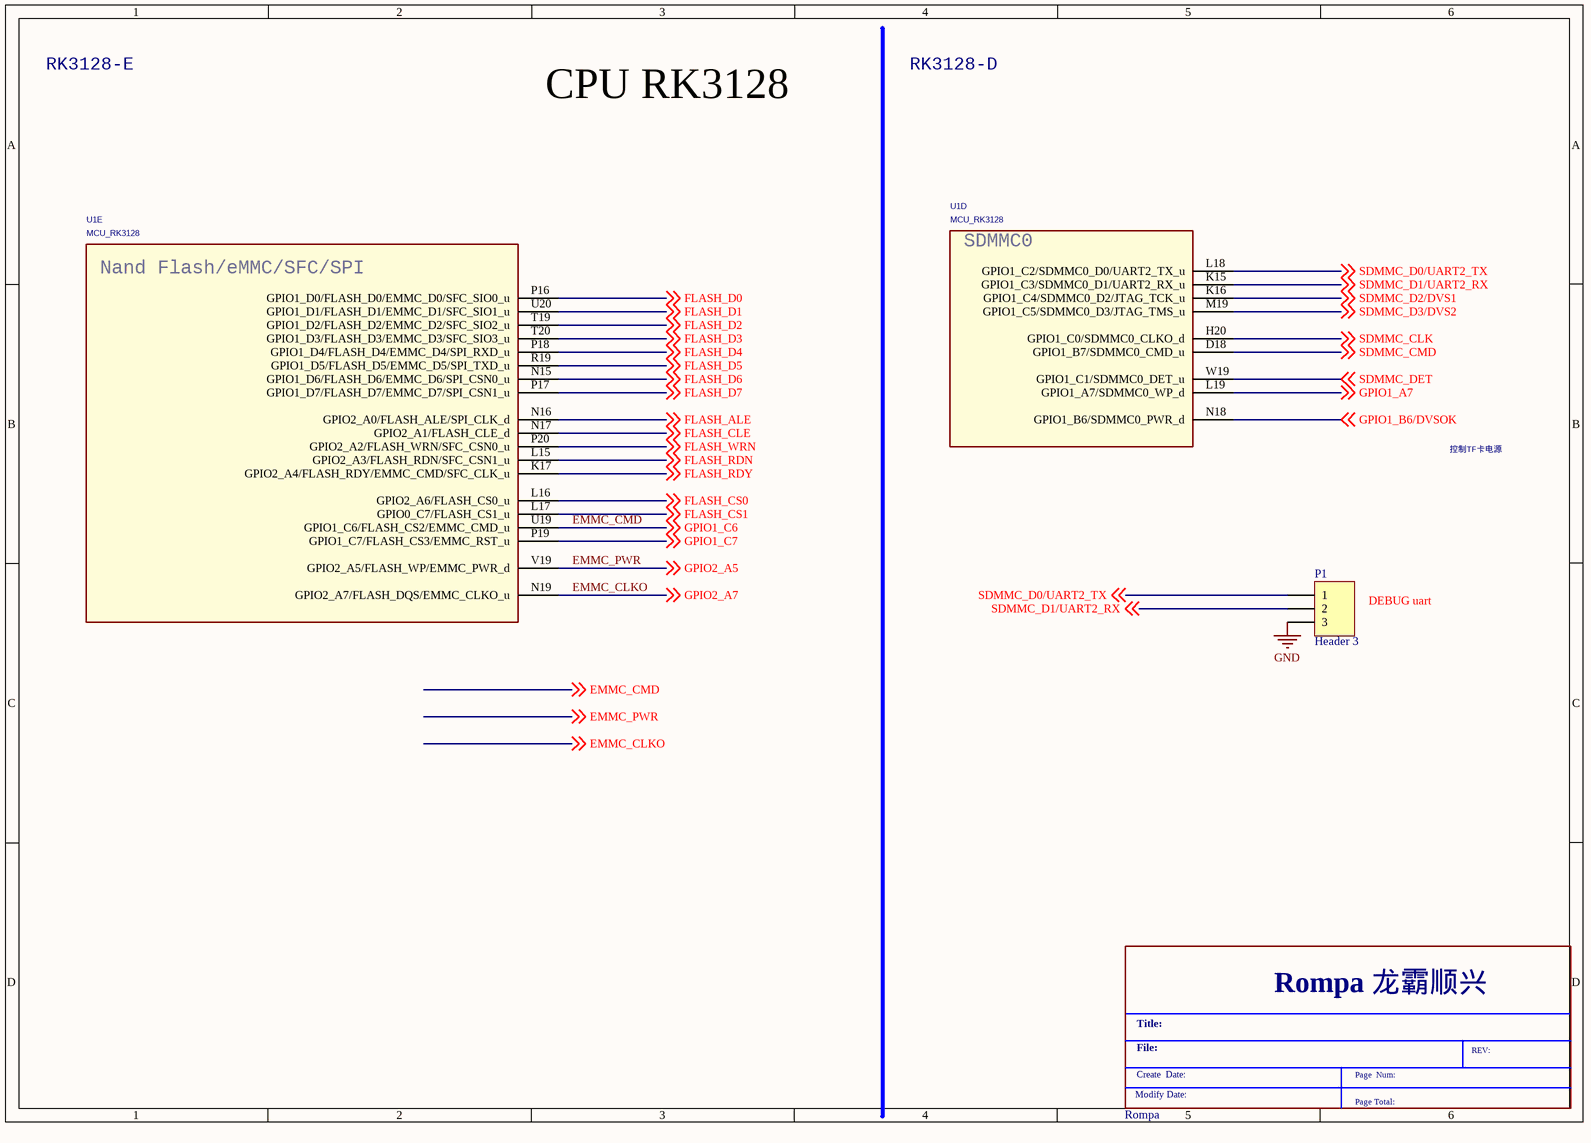
[diagram p19: 08_RK3128_Flash_SDMMC.SchDoc]

### Parts
(Parts that share a designator on the sheet are numbered #1, #2 ... from top to bottom, then left to right.)
*#18  Rompa  (graphical)
P1  Header 3  [HDR1X3]
U1  MCU_RK3128  [BGA316-14X14-0.65]  (parts D,E of 12)

### Nets
GND: P1.3
EMMC_CLKO: U1.N19(GPIO2_A7/FLASH_DQS/EMMC_CLKO_u) ; off-sheet GPIO2_A7, off-sheet EMMC_CLKO  [also labelled GPIO2_A7]
EMMC_CMD: U1.U19(GPIO1_C6/FLASH_CS2/EMMC_CMD_u) ; off-sheet GPIO1_C6, off-sheet EMMC_CMD  [also labelled GPIO1_C6]
EMMC_PWR: U1.V19(GPIO2_A5/FLASH_WP/EMMC_PWR_d) ; off-sheet GPIO2_A5, off-sheet EMMC_PWR  [also labelled GPIO2_A5]
FLASH_ALE: U1.N16(GPIO2_A0/FLASH_ALE/SPI_CLK_d) ; off-sheet FLASH_ALE
FLASH_CLE: U1.N17(GPIO2_A1/FLASH_CLE_d) ; off-sheet FLASH_CLE
FLASH_CS0: U1.L16(GPIO2_A6/FLASH_CS0_u) ; off-sheet FLASH_CS0
FLASH_CS1: U1.L17(GPIO0_C7/FLASH_CS1_u) ; off-sheet FLASH_CS1
FLASH_D0: U1.P16(GPIO1_D0/FLASH_D0/EMMC_D0/SFC_SIO0_u) ; off-sheet FLASH_D0
FLASH_D1: U1.U20(GPIO1_D1/FLASH_D1/EMMC_D1/SFC_SIO1_u) ; off-sheet FLASH_D1
FLASH_D2: U1.T19(GPIO1_D2/FLASH_D2/EMMC_D2/SFC_SIO2_u) ; off-sheet FLASH_D2
FLASH_D3: U1.T20(GPIO1_D3/FLASH_D3/EMMC_D3/SFC_SIO3_u) ; off-sheet FLASH_D3
FLASH_D4: U1.P18(GPIO1_D4/FLASH_D4/EMMC_D4/SPI_RXD_u) ; off-sheet FLASH_D4
FLASH_D5: U1.R19(GPIO1_D5/FLASH_D5/EMMC_D5/SPI_TXD_u) ; off-sheet FLASH_D5
FLASH_D6: U1.N15(GPIO1_D6/FLASH_D6/EMMC_D6/SPI_CSN0_u) ; off-sheet FLASH_D6
FLASH_D7: U1.P17(GPIO1_D7/FLASH_D7/EMMC_D7/SPI_CSN1_u) ; off-sheet FLASH_D7
FLASH_RDN: U1.L15(GPIO2_A3/FLASH_RDN/SFC_CSN1_u) ; off-sheet FLASH_RDN
FLASH_RDY: U1.K17(GPIO2_A4/FLASH_RDY/EMMC_CMD/SFC_CLK_u) ; off-sheet FLASH_RDY
FLASH_WRN: U1.P20(GPIO2_A2/FLASH_WRN/SFC_CSN0_u) ; off-sheet FLASH_WRN
GPIO1_A7: U1.L19(GPIO1_A7/SDMMC0_WP_d) ; off-sheet GPIO1_A7
GPIO1_B6/DVSOK: U1.N18(GPIO1_B6/SDMMC0_PWR_d) ; off-sheet GPIO1_B6/DVSOK
GPIO1_C7: U1.P19(GPIO1_C7/FLASH_CS3/EMMC_RST_u) ; off-sheet GPIO1_C7
SDMMC_CLK: U1.H20(GPIO1_C0/SDMMC0_CLKO_d) ; off-sheet SDMMC_CLK
SDMMC_CMD: U1.D18(GPIO1_B7/SDMMC0_CMD_u) ; off-sheet SDMMC_CMD
SDMMC_D0/UART2_TX: P1.1 U1.L18(GPIO1_C2/SDMMC0_D0/UART2_TX_u) ; off-sheet SDMMC_D0/UART2_TX
SDMMC_D1/UART2_RX: P1.2 U1.K15(GPIO1_C3/SDMMC0_D1/UART2_RX_u) ; off-sheet SDMMC_D1/UART2_RX
SDMMC_D2/DVS1: U1.K16(GPIO1_C4/SDMMC0_D2/JTAG_TCK_u) ; off-sheet SDMMC_D2/DVS1
SDMMC_D3/DVS2: U1.M19(GPIO1_C5/SDMMC0_D3/JTAG_TMS_u) ; off-sheet SDMMC_D3/DVS2
SDMMC_DET: U1.W19(GPIO1_C1/SDMMC0_DET_u) ; off-sheet SDMMC_DET

### Notes on the sheet
- RK3128-E
- RK3128-D
- CPU RK3128
- 控制TF卡电源
- DEBUG uart
- (in symbol MCU_RK3128, part D) SDMMC0
- (in symbol MCU_RK3128, part E) Nand Flash/eMMC/SFC/SPI
- (in symbol Rompa) Rompa 龙霸顺兴; Title:; File:; REV:; Create  Date:; Page  Num:; Modify Date:; Page Total:

### Library data of the parts
P1 = Header 3: Header, 3-Pin Debug Uart; LatestRevisionDate: 17-Jul-2002; LatestRevisionNote: Re-released for DXP Platform.; Publisher: Altium Limited

## Sheet 07_RK3128_DDR.SchDoc
size 297 x 209 mm
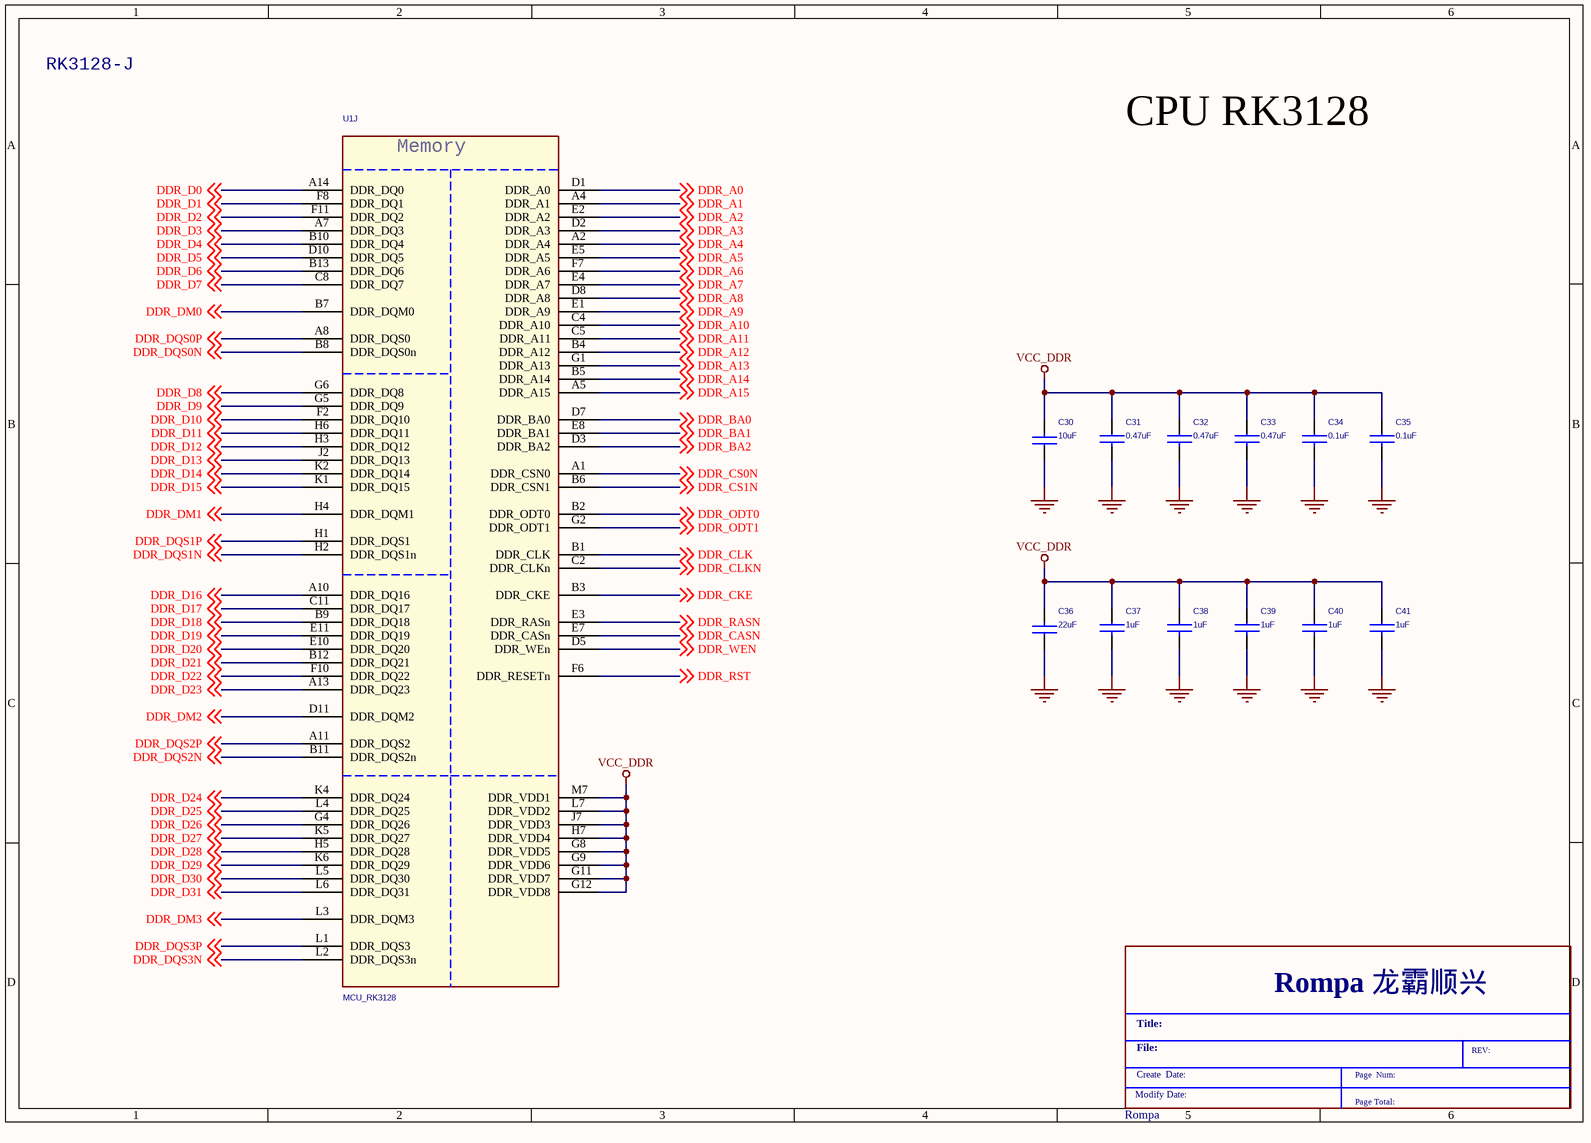
[diagram p20: 07_RK3128_DDR.SchDoc]

### Parts
(Parts that share a designator on the sheet are numbered #1, #2 ... from top to bottom, then left to right.)
*#19  Rompa  (graphical)
C30  10uF  [C0805]
C31  0.47uF  [C0402]
C32  0.47uF  [C0402]
C33  0.47uF  [C0402]
C34  0.1uF  [C0402]
C35  0.1uF  [C0402]
C36  22uF  [C0805]
C37  1uF  [C0402]
C38  1uF  [C0402]
C39  1uF  [C0402]
C40  1uF  [C0402]
C41  1uF  [C0402]
U1  MCU_RK3128  [BGA316-14X14-0.65]  (part J of 12)

### Nets
GND: C30.1 C31.2 C32.2 C33.2 C34.2 C35.2 C36.1 C37.2 C38.2 C39.2 C40.2 C41.2
VCC_DDR: C30.2 C31.1 C32.1 C33.1 C34.1 C35.1 C36.2 C37.1 C38.1 C39.1 C40.1 C41.1 U1.G8(DDR_VDD5) U1.G9(DDR_VDD6) U1.G11(DDR_VDD7) U1.G12(DDR_VDD8) U1.H7(DDR_VDD4) U1.J7(DDR_VDD3) U1.L7(DDR_VDD2) U1.M7(DDR_VDD1)
DDR_A0: U1.D1(DDR_A0) ; off-sheet DDR_A0
DDR_A1: U1.A4(DDR_A1) ; off-sheet DDR_A1
DDR_A2: U1.E2(DDR_A2) ; off-sheet DDR_A2
DDR_A3: U1.D2(DDR_A3) ; off-sheet DDR_A3
DDR_A4: U1.A2(DDR_A4) ; off-sheet DDR_A4
DDR_A5: U1.E5(DDR_A5) ; off-sheet DDR_A5
DDR_A6: U1.F7(DDR_A6) ; off-sheet DDR_A6
DDR_A7: U1.E4(DDR_A7) ; off-sheet DDR_A7
DDR_A8: U1.D8(DDR_A8) ; off-sheet DDR_A8
DDR_A9: U1.E1(DDR_A9) ; off-sheet DDR_A9
DDR_A10: U1.C4(DDR_A10) ; off-sheet DDR_A10
DDR_A11: U1.C5(DDR_A11) ; off-sheet DDR_A11
DDR_A12: U1.B4(DDR_A12) ; off-sheet DDR_A12
DDR_A13: U1.G1(DDR_A13) ; off-sheet DDR_A13
DDR_A14: U1.B5(DDR_A14) ; off-sheet DDR_A14
DDR_A15: U1.A5(DDR_A15) ; off-sheet DDR_A15
DDR_BA0: U1.D7(DDR_BA0) ; off-sheet DDR_BA0
DDR_BA1: U1.E8(DDR_BA1) ; off-sheet DDR_BA1
DDR_BA2: U1.D3(DDR_BA2) ; off-sheet DDR_BA2
DDR_CASN: U1.E7(DDR_CASn) ; off-sheet DDR_CASN
DDR_CKE: U1.B3(DDR_CKE) ; off-sheet DDR_CKE
DDR_CLK: U1.B1(DDR_CLK) ; off-sheet DDR_CLK
DDR_CLKN: U1.C2(DDR_CLKn) ; off-sheet DDR_CLKN
DDR_CS0N: U1.A1(DDR_CSN0) ; off-sheet DDR_CS0N
DDR_CS1N: U1.B6(DDR_CSN1) ; off-sheet DDR_CS1N
DDR_D0: U1.A14(DDR_DQ0) ; off-sheet DDR_D0
DDR_D1: U1.F8(DDR_DQ1) ; off-sheet DDR_D1
DDR_D2: U1.F11(DDR_DQ2) ; off-sheet DDR_D2
DDR_D3: U1.A7(DDR_DQ3) ; off-sheet DDR_D3
DDR_D4: U1.B10(DDR_DQ4) ; off-sheet DDR_D4
DDR_D5: U1.D10(DDR_DQ5) ; off-sheet DDR_D5
DDR_D6: U1.B13(DDR_DQ6) ; off-sheet DDR_D6
DDR_D7: U1.C8(DDR_DQ7) ; off-sheet DDR_D7
DDR_D8: U1.G6(DDR_DQ8) ; off-sheet DDR_D8
DDR_D9: U1.G5(DDR_DQ9) ; off-sheet DDR_D9
DDR_D10: U1.F2(DDR_DQ10) ; off-sheet DDR_D10
DDR_D11: U1.H6(DDR_DQ11) ; off-sheet DDR_D11
DDR_D12: U1.H3(DDR_DQ12) ; off-sheet DDR_D12
DDR_D13: U1.J2(DDR_DQ13) ; off-sheet DDR_D13
DDR_D14: U1.K2(DDR_DQ14) ; off-sheet DDR_D14
DDR_D15: U1.K1(DDR_DQ15) ; off-sheet DDR_D15
DDR_D16: U1.A10(DDR_DQ16) ; off-sheet DDR_D16
DDR_D17: U1.C11(DDR_DQ17) ; off-sheet DDR_D17
DDR_D18: U1.B9(DDR_DQ18) ; off-sheet DDR_D18
DDR_D19: U1.E11(DDR_DQ19) ; off-sheet DDR_D19
DDR_D20: U1.E10(DDR_DQ20) ; off-sheet DDR_D20
DDR_D21: U1.B12(DDR_DQ21) ; off-sheet DDR_D21
DDR_D22: U1.F10(DDR_DQ22) ; off-sheet DDR_D22
DDR_D23: U1.A13(DDR_DQ23) ; off-sheet DDR_D23
DDR_D24: U1.K4(DDR_DQ24) ; off-sheet DDR_D24
DDR_D25: U1.L4(DDR_DQ25) ; off-sheet DDR_D25
DDR_D26: U1.G4(DDR_DQ26) ; off-sheet DDR_D26
DDR_D27: U1.K5(DDR_DQ27) ; off-sheet DDR_D27
DDR_D28: U1.H5(DDR_DQ28) ; off-sheet DDR_D28
DDR_D29: U1.K6(DDR_DQ29) ; off-sheet DDR_D29
DDR_D30: U1.L5(DDR_DQ30) ; off-sheet DDR_D30
DDR_D31: U1.L6(DDR_DQ31) ; off-sheet DDR_D31
DDR_DM0: U1.B7(DDR_DQM0) ; off-sheet DDR_DM0
DDR_DM1: U1.H4(DDR_DQM1) ; off-sheet DDR_DM1
DDR_DM2: U1.D11(DDR_DQM2) ; off-sheet DDR_DM2
DDR_DM3: U1.L3(DDR_DQM3) ; off-sheet DDR_DM3
DDR_DQS0N: U1.B8(DDR_DQS0n) ; off-sheet DDR_DQS0N
DDR_DQS0P: U1.A8(DDR_DQS0) ; off-sheet DDR_DQS0P
DDR_DQS1N: U1.H2(DDR_DQS1n) ; off-sheet DDR_DQS1N
DDR_DQS1P: U1.H1(DDR_DQS1) ; off-sheet DDR_DQS1P
DDR_DQS2N: U1.B11(DDR_DQS2n) ; off-sheet DDR_DQS2N
DDR_DQS2P: U1.A11(DDR_DQS2) ; off-sheet DDR_DQS2P
DDR_DQS3N: U1.L2(DDR_DQS3n) ; off-sheet DDR_DQS3N
DDR_DQS3P: U1.L1(DDR_DQS3) ; off-sheet DDR_DQS3P
DDR_ODT0: U1.B2(DDR_ODT0) ; off-sheet DDR_ODT0
DDR_ODT1: U1.G2(DDR_ODT1) ; off-sheet DDR_ODT1
DDR_RASN: U1.E3(DDR_RASn) ; off-sheet DDR_RASN
DDR_RST: U1.F6(DDR_RESETn) ; off-sheet DDR_RST
DDR_WEN: U1.D5(DDR_WEn) ; off-sheet DDR_WEN

### Notes on the sheet
- RK3128-J
- CPU RK3128
- (in symbol MCU_RK3128, part J) Memory
- (in symbol Rompa) Rompa 龙霸顺兴; Title:; File:; REV:; Create  Date:; Page  Num:; Modify Date:; Page Total:

### Library data of the parts
C30 = CAP NP: RoHS CHIP CAP 10uF +10/-10% X5R
C31-C35 C37-C41 = CAP NP_0
C36 = CAP NP: RoHS CHIP CAP 22uF +10/-10% X5R

## Sheet 06_RK3128_USB_ADC_Crystal.SchDoc
size 297 x 209 mm
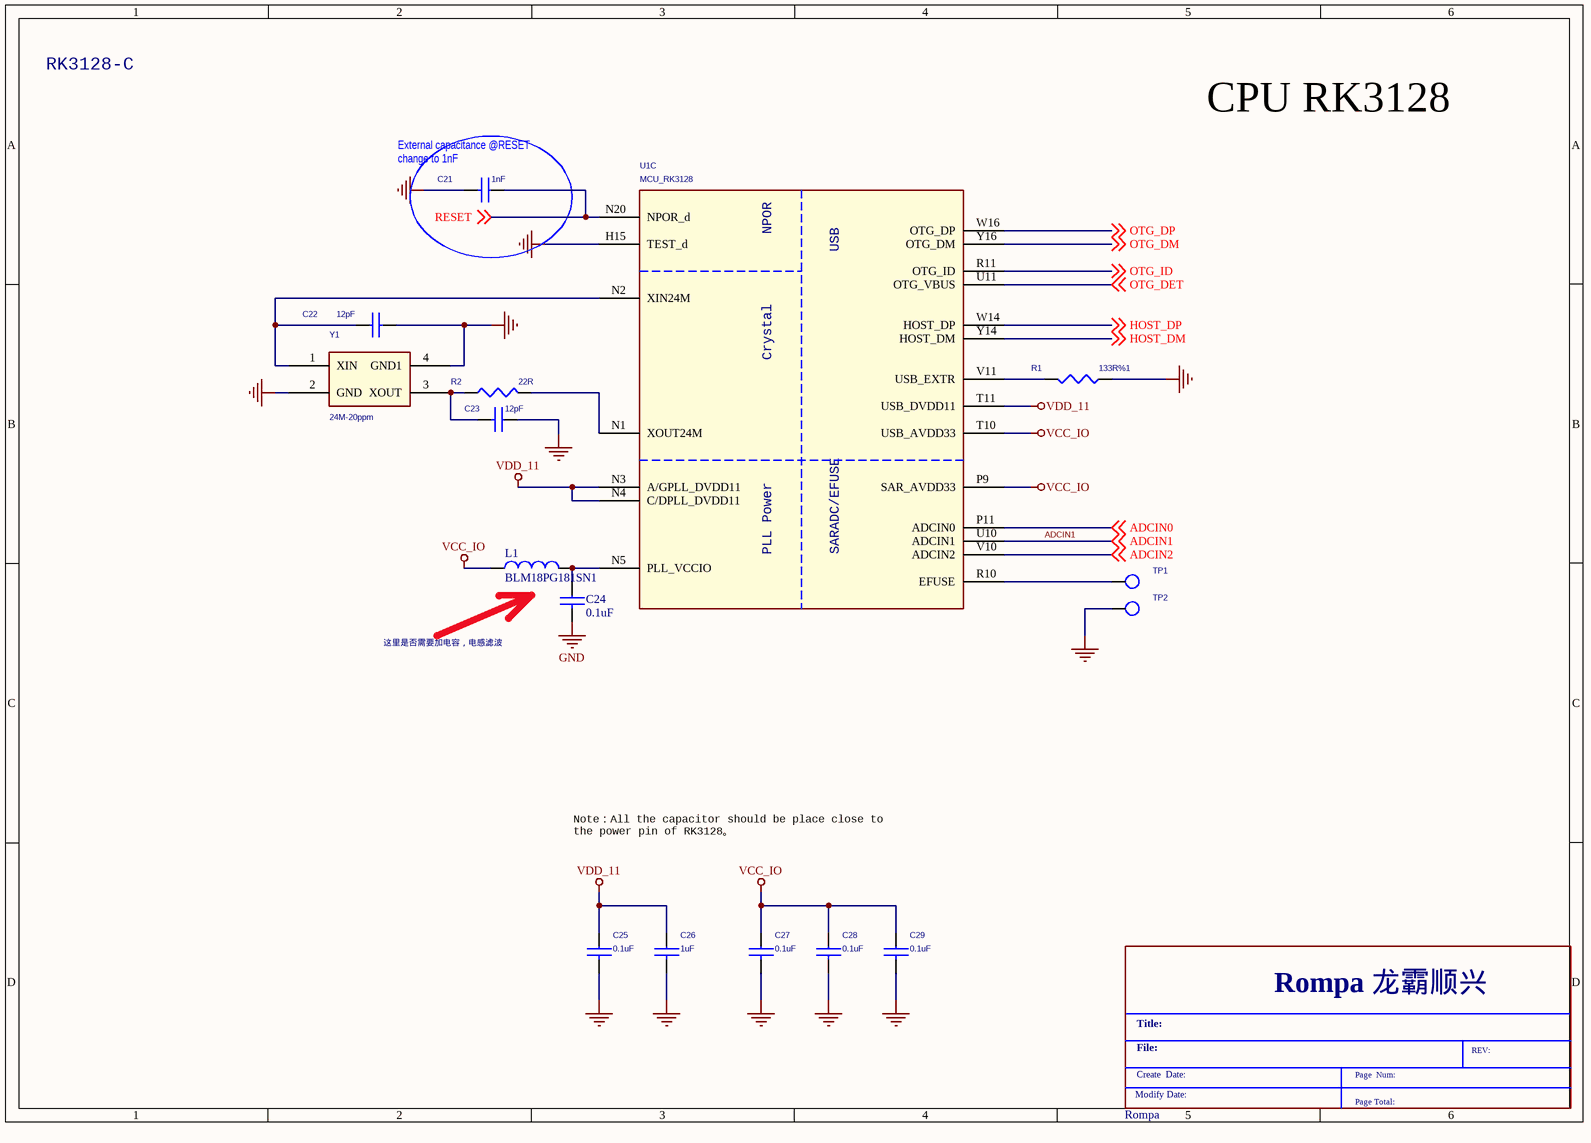
[diagram p21: 06_RK3128_USB_ADC_Crystal.SchDoc]

### Parts
(Parts that share a designator on the sheet are numbered #1, #2 ... from top to bottom, then left to right.)
*#20  Rompa  (graphical)
C21  1nF  [C0402]
C22  12pF  [C0402]
C23  12pF  [C0402]
C24  0.1uF  [C0402]
C25  0.1uF  [C0402]
C26  1uF  [C0402]
C27  0.1uF  [C0402]
C28  0.1uF  [C0402]
C29  0.1uF  [C0402]
L1  BLM18PG181SN1  [L0603]
R1  133R%1  [R0402]
R2  22R  [R0402]
TP1  TEST  [TEST]  (value not drawn)
TP2  TEST  [TEST]  (value not drawn)
U1  MCU_RK3128  [BGA316-14X14-0.65]  (part C of 12)
Y1  24M-20ppm  [CRY-3225]

### Nets
GND: C21.2 C22.2 C23.1 C24.2 C25.2 C26.2 C27.2 C28.2 C29.2 R1.1 TP2.1 U1.H15(TEST_d) Y1.2(GND) Y1.4(GND1)
VCC_IO: C27.1 C28.1 C29.1 L1.1 U1.P9(SAR_AVDD33) U1.T10(USB_AVDD33)
VDD_11: C25.1 C26.1 U1.N3(A/GPLL_DVDD11) U1.N4(C/DPLL_DVDD11) U1.T11(USB_DVDD11)
ADCIN0: U1.P11(ADCIN0) ; off-sheet ADCIN0
ADCIN1: U1.U10(ADCIN1) ; off-sheet ADCIN1
ADCIN2: U1.V10(ADCIN2) ; off-sheet ADCIN2
HOST_DM: U1.Y14(HOST_DM) ; off-sheet HOST_DM
HOST_DP: U1.W14(HOST_DP) ; off-sheet HOST_DP
OTG_DET: U1.U11(OTG_VBUS) ; off-sheet OTG_DET
OTG_DM: U1.Y16(OTG_DM) ; off-sheet OTG_DM
OTG_DP: U1.W16(OTG_DP) ; off-sheet OTG_DP
OTG_ID: U1.R11(OTG_ID) ; off-sheet OTG_ID
RESET: C21.1 U1.N20(NPOR_d) ; off-sheet RESET
NetC22_1: C22.1 U1.N2(XIN24M) Y1.1(XIN)
NetC23_2: C23.2 R2.1 Y1.3(XOUT)
NetC24_1: C24.1 L1.2 U1.N5(PLL_VCCIO)
NetR1_2: R1.2 U1.V11(USB_EXTR)
NetR2_2: R2.2 U1.N1(XOUT24M)
NetTP1_1: TP1.1 U1.R10(EFUSE)

### Notes on the sheet
- RK3128-C
- CPU RK3128
- (near C21) External capacitance @RESET
  change to 1nF
- 这里是否需要加电容，电感滤波
- Note：All the capacitor should be place close to
  the power pin of RK3128。
- (in symbol MCU_RK3128, part C) NPOR; USB; Crystal; PLL Power; SARADC/EFUSE
- (in symbol Rompa) Rompa 龙霸顺兴; Title:; File:; REV:; Create  Date:; Page  Num:; Modify Date:; Page Total:

### Library data of the parts
C21 = CAP NP: RoHS CHIP CAP 1nF +10/-10% X5R
C22-C24 = CAP NP
C25 C27-C29 = CAP NP: RoHS CHIP CAP 0.1uF +10/-10% X7R
C26 = CAP NP: RoHS CHIP CAP 1uF +10/-10% X7R
L1 = Inductor: FERRITE BEAD 180 OHM 0603 1LN; Code_IEC: 1005; Published: 8-Jun-2000; LatestRevisionDate: 17-Jul-2002; LatestRevisionNote: Re-released for DXP Platform.; PackageReference: 0402-A; Publisher: Altium Limited; Code_JEITA: 0402
R1 = RES 1B: ROHS CHIP RES 43.2R 1/16W 1%
R2 = RES 1B
TP1 TP2 = TESTPOINT1_0
Y1 = CRYSTAL-4_0

## Sheet 05_RK3128_VDD.SchDoc
size 297 x 209 mm
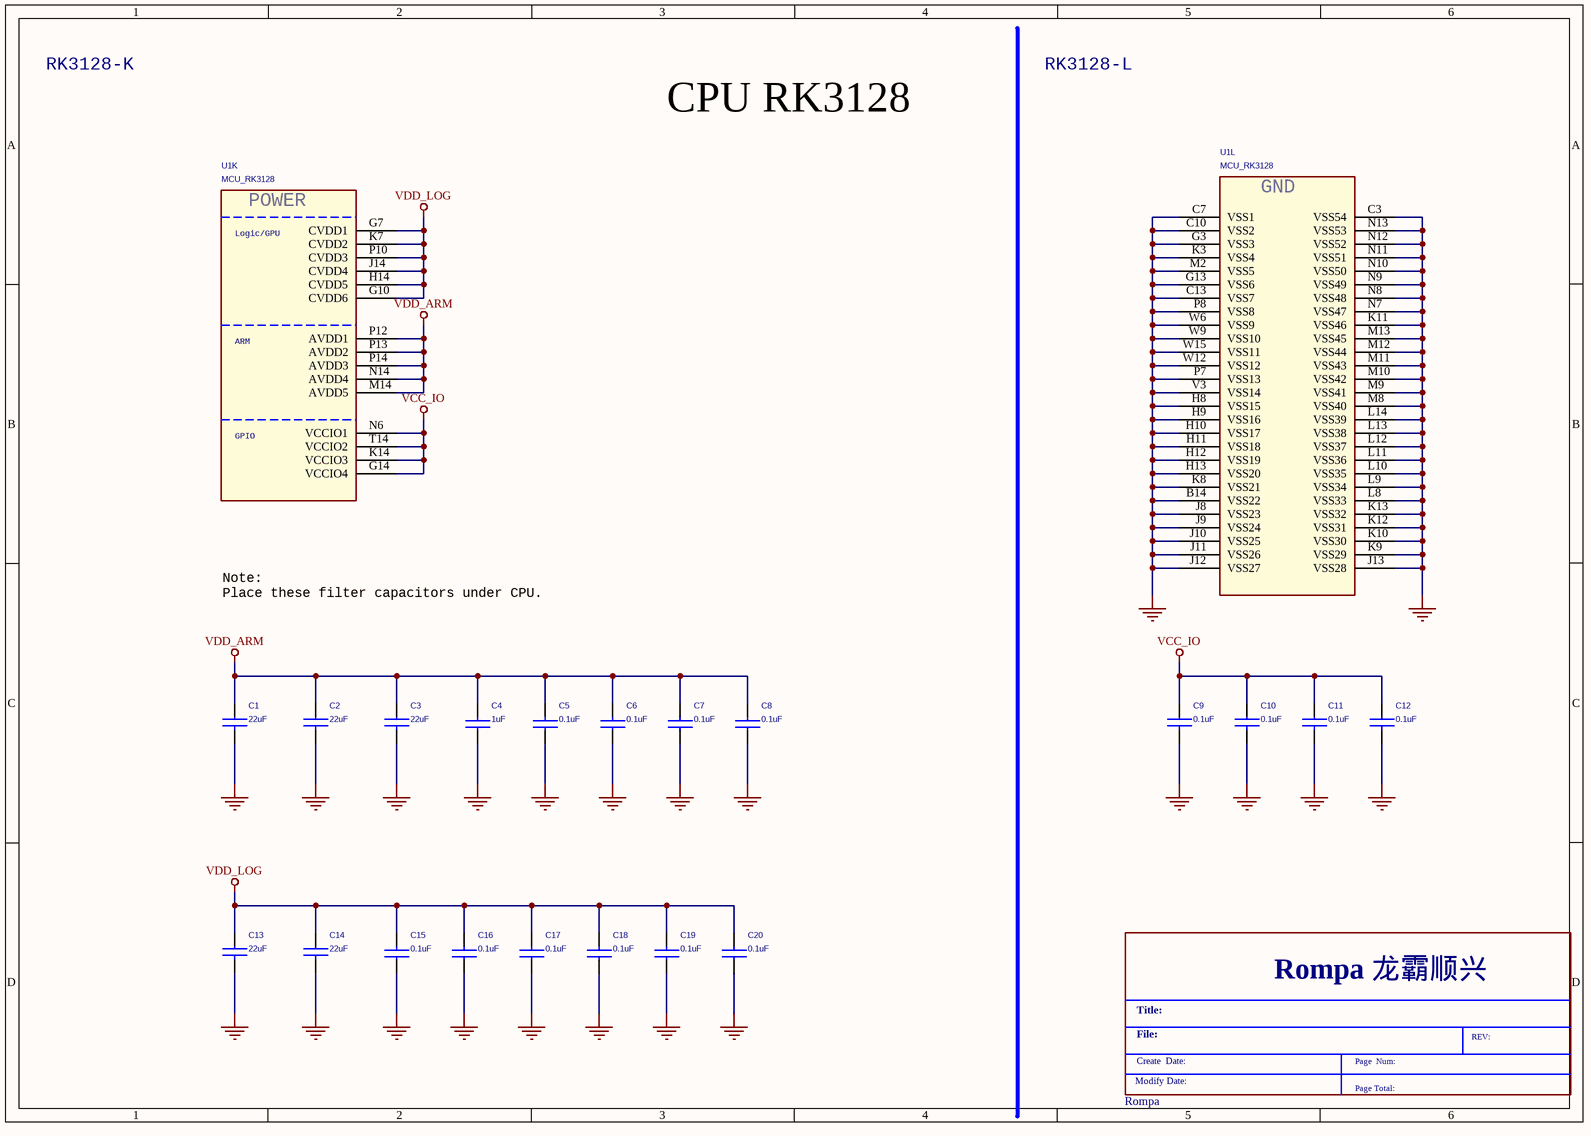
[diagram p22: 05_RK3128_VDD.SchDoc]

### Parts
(Parts that share a designator on the sheet are numbered #1, #2 ... from top to bottom, then left to right.)
*#21  Rompa  (graphical)
C1  22uF  [C0805]
C2  22uF  [C0805]
C3  22uF  [C0805]
C4  1uF  [C0402]
C5  0.1uF  [C0402]
C6  0.1uF  [C0402]
C7  0.1uF  [C0402]
C8  0.1uF  [C0402]
C9  0.1uF  [C0402]
C10  0.1uF  [C0402]
C11  0.1uF  [C0402]
C12  0.1uF  [C0402]
C13  22uF  [C0805]
C14  22uF  [C0805]
C15  0.1uF  [C0402]
C16  0.1uF  [C0402]
C17  0.1uF  [C0402]
C18  0.1uF  [C0402]
C19  0.1uF  [C0402]
C20  0.1uF  [C0402]
U1  MCU_RK3128  [BGA316-14X14-0.65]  (parts K,L of 12)

### Nets
GND: C1.2 C2.2 C3.2 C4.1 C5.1 C6.1 C7.1 C8.1 C9.2 C10.2 C11.2 C12.2 C13.2 C14.2 C15.1 C16.1 C17.1 C18.1 C19.1 C20.1 U1.B14(VSS22) U1.C3(VSS54) U1.C7(VSS1) U1.C10(VSS2) U1.C13(VSS7) U1.G3(VSS3) U1.G13(VSS6) U1.H8(VSS15) U1.H9(VSS16) U1.H10(VSS17) U1.H11(VSS18) U1.H12(VSS19) U1.H13(VSS20) U1.J8(VSS23) U1.J9(VSS24) U1.J10(VSS25) U1.J11(VSS26) U1.J12(VSS27) U1.J13(VSS28) U1.K3(VSS4) U1.K8(VSS21) U1.K9(VSS29) U1.K10(VSS30) U1.K11(VSS46) U1.K12(VSS31) U1.K13(VSS32) U1.L8(VSS33) U1.L9(VSS34) U1.L10(VSS35) U1.L11(VSS36) U1.L12(VSS37) U1.L13(VSS38) U1.L14(VSS39) U1.M2(VSS5) U1.M8(VSS40) U1.M9(VSS41) U1.M10(VSS42) U1.M11(VSS43) U1.M12(VSS44) U1.M13(VSS45) U1.N7(VSS47) U1.N8(VSS48) U1.N9(VSS49) U1.N10(VSS50) U1.N11(VSS51) U1.N12(VSS52) U1.N13(VSS53) U1.P7(VSS13) U1.P8(VSS8) U1.V3(VSS14) U1.W6(VSS9) U1.W9(VSS10) U1.W12(VSS12) U1.W15(VSS11)
VCC_IO: C9.1 C10.1 C11.1 C12.1 U1.G14(VCCIO4) U1.K14(VCCIO3) U1.N6(VCCIO1) U1.T14(VCCIO2)
VDD_ARM: C1.1 C2.1 C3.1 C4.2 C5.2 C6.2 C7.2 C8.2 U1.M14(AVDD5) U1.N14(AVDD4) U1.P12(AVDD1) U1.P13(AVDD2) U1.P14(AVDD3)
VDD_LOG: C13.1 C14.1 C15.2 C16.2 C17.2 C18.2 C19.2 C20.2 U1.G7(CVDD1) U1.G10(CVDD6) U1.H14(CVDD5) U1.J14(CVDD4) U1.K7(CVDD2) U1.P10(CVDD3)

### Notes on the sheet
- RK3128-K
- RK3128-L
- CPU RK3128
- Note:
  Place these filter capacitors under CPU.
- (in symbol MCU_RK3128, part K) POWER; Logic/GPU; ARM; GPIO
- (in symbol MCU_RK3128, part L) GND
- (in symbol Rompa) Rompa 龙霸顺兴; Title:; File:; REV:; Create  Date:; Page  Num:; Modify Date:; Page Total:

### Library data of the parts
C1-C3 C13 C14 = CAP NP: RoHS CHIP CAP 22uF +10/-10% X5R
C4 = CAP NP: RoHS CHIP CAP 1uF +10/-10% X5R
C5-C12 C15-C20 = CAP NP: RoHS CHIP CAP 0.1uF +10/-10% X7R

## Sheet 04_Power_Diagram_rk816.SchDoc
size 297 x 209 mm
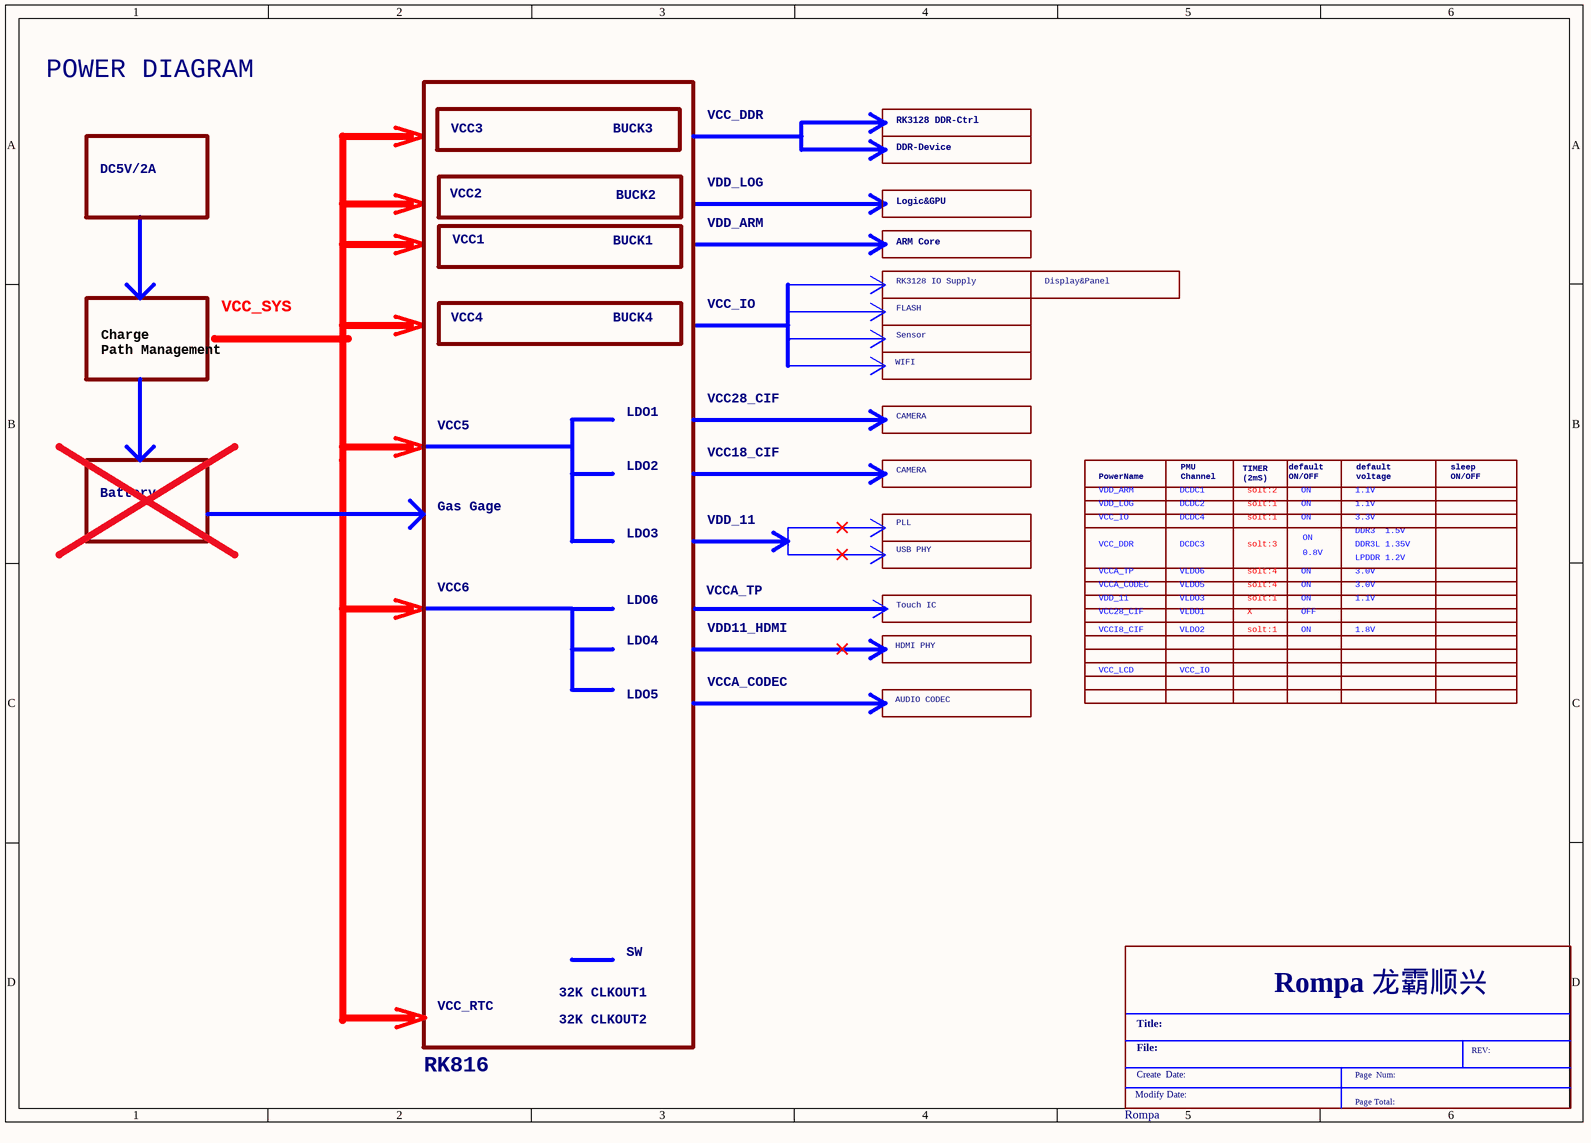
[diagram p23: 04_Power_Diagram_rk816.SchDoc]

### Parts
(Parts that share a designator on the sheet are numbered #1, #2 ... from top to bottom, then left to right.)
*#22  Rompa  (graphical)

### Notes on the sheet
- POWER DIAGRAM
- VCC3
- BUCK3
- VCC_DDR
- RK3128 DDR-Ctrl
- DC5V/2A
- VCC2
- BUCK2
- VDD_LOG
- DDR-Device
- Logic&GPU
- VCC1
- BUCK1
- VDD_ARM
- ARM Core
- VCC_SYS
- VCC4
- BUCK4
- VCC_IO
- RK3128 IO Supply
- FLASH
- Sensor
- Display&Panel
- Charge
  Path Management
- VCC28_CIF
- WIFI
- VCC5
- LDO2
- LDO1
- VCC18_CIF
- CAMERA
- Battery
- Gas Gage
- LDO3
- VDD_11
- PLL
- PowerName
- DCDC4
- PMU
  Channel
- DCDC2
- DCDC1
- TIMER
  (2mS)
- solt:1
- solt:2
- default
  ON/OFF
- ON
- default
  voltage
- 1.1V
- DDR3  1.5V
- 3.3V
- sleep
  ON/OFF
- VCC6
- LDO6
- VCCA_TP
- Touch IC
- USB PHY
- VCCA_CODEC
- DCDC3
- VLDO3
- VLDO5
- VLDO6
- solt:3
- solt:4
- 0.8V
- 3.0V
- LPDDR 1.2V
- DDR3L 1.35V
- LDO4
- VDD11_HDMI
- HDMI PHY
- VCC_LCD
- VCCI8_CIF
- VLDO1
- VLDO2
- X
- OFF
- 1.8V
- LDO5
- AUDIO CODEC
- VCC_RTC
- 32K CLKOUT1
- SW
- RK816
- 32K CLKOUT2
- (in symbol Rompa) Rompa 龙霸顺兴; Title:; File:; REV:; Create  Date:; Page  Num:; Modify Date:; Page Total:

## Sheet 04_Power_Diagram.SchDoc
size 297 x 209 mm
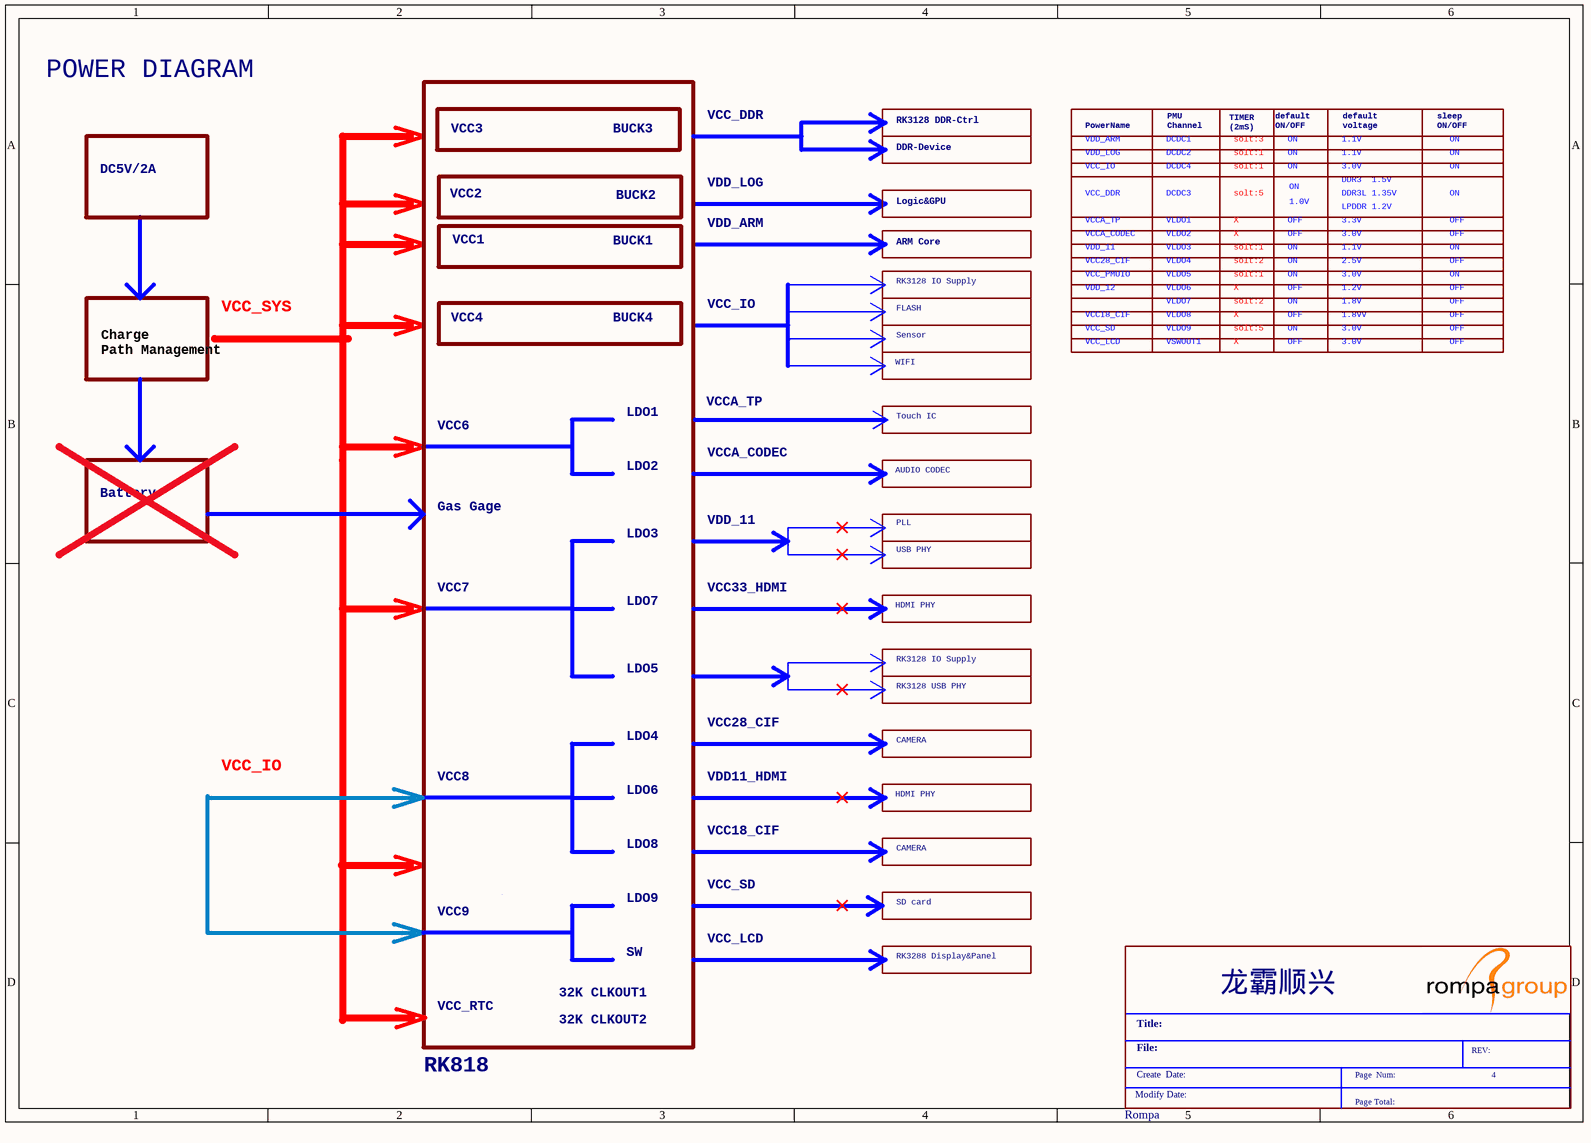
[diagram p24: 04_Power_Diagram.SchDoc]

### Parts
(Parts that share a designator on the sheet are numbered #1, #2 ... from top to bottom, then left to right.)
*#23  Rompa  Schematic Page Number: 4  (graphical)

### Notes on the sheet
- POWER DIAGRAM
- VCC3
- BUCK3
- VCC_DDR
- RK3128 DDR-Ctrl
- PowerName
- PMU
  Channel
- TIMER
  (2mS)
- default
  ON/OFF
- default
  voltage
- sleep
  ON/OFF
- DC5V/2A
- VCC2
- BUCK2
- VDD_LOG
- DDR-Device
- Logic&GPU
- VDD_ARM
- VCC_IO
- DCDC4
- DCDC3
- DCDC2
- DCDC1
- solt:1
- solt:5
- solt:3
- ON
- 1.0V
- 1.1V
- DDR3  1.5V
- DDR3L 1.35V
- 3.0V
- VCC1
- BUCK1
- ARM Core
- VDD_11
- VCCA_TP
- VCCA_CODEC
- VCC28_CIF
- VLDO4
- VLDO3
- VLDO2
- VLDO1
- solt:2
- X
- OFF
- 3.3V
- LPDDR 1.2V
- 2.5V
- VCC_SYS
- VCC4
- BUCK4
- RK3128 IO Supply
- FLASH
- Sensor
- VCC_SD
- VCC_PMUIO
- VCCI8_CIF
- VDD_12
- VLDO5
- VLDO9
- VLDO8
- VLDO7
- VLDO6
- 1.2V
- 1.8VV
- 1.8V
- Charge
  Path Management
- WIFI
- VCC_LCD
- VSWOUT1
- VCC6
- LDO2
- LDO1
- AUDIO CODEC
- Touch IC
- Battery
- Gas Gage
- LDO3
- PLL
- VCC7
- LDO7
- VCC33_HDMI
- HDMI PHY
- USB PHY
- LDO5
- LDO4
- RK3128 USB PHY
- CAMERA
- VCC8
- LDO6
- VDD11_HDMI
- LDO8
- VCC18_CIF
- VCC9
- LDO9
- SD card
- VCC_RTC
- 32K CLKOUT1
- SW
- RK3288 Display&Panel
- RK818
- 32K CLKOUT2
- (in symbol Rompa) 龙霸顺兴; Title:; File:; REV:; Create  Date:; Page  Num:; Modify Date:; Page Total:

## Sheet 03_Peripherals.SchDoc
size 420 x 297 mm
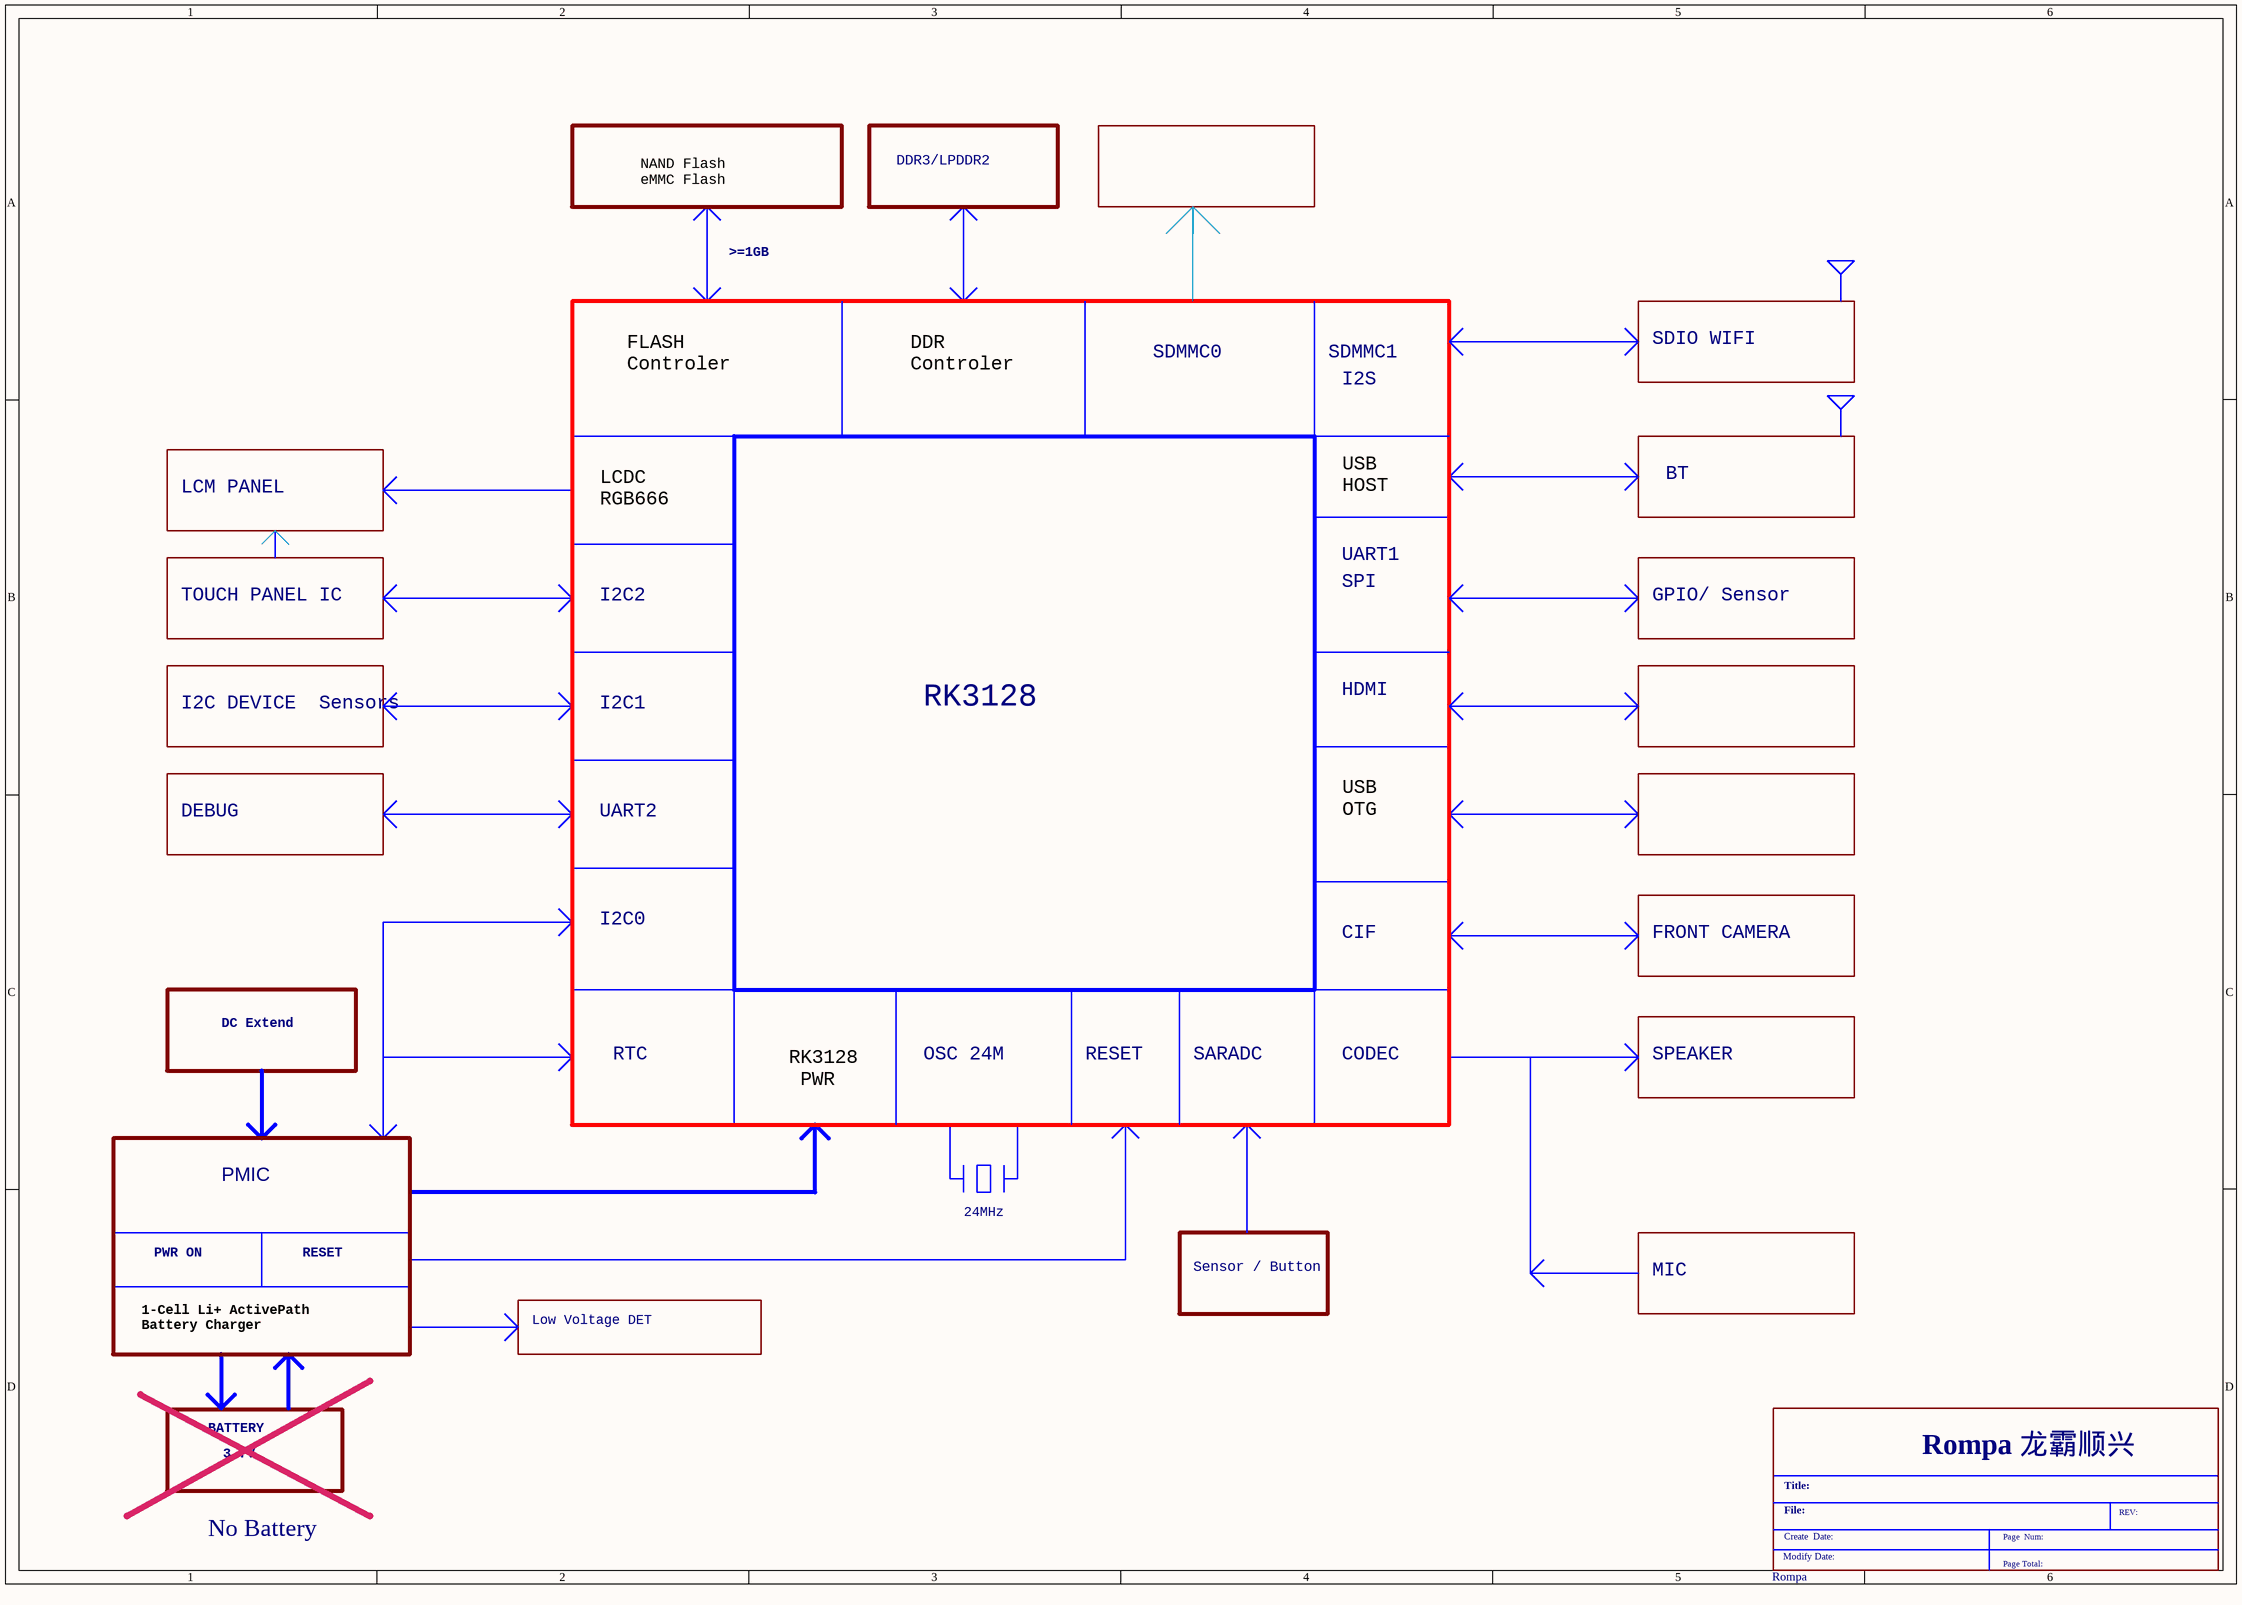
[diagram p25: 03_Peripherals.SchDoc]

### Parts
(Parts that share a designator on the sheet are numbered #1, #2 ... from top to bottom, then left to right.)
*#24  Rompa  (graphical)

### Notes on the sheet
- NAND Flash
  eMMC Flash
- DDR3/LPDDR2
- >=1GB
- FLASH
  Controler
- DDR
  Controler
- SDMMC0
- SDMMC1
- I2S
- SDIO WIFI
- LCM PANEL
- LCDC
  RGB666
- USB
  HOST
- BT
- SPI
- UART1
- TOUCH PANEL IC
- I2C2
- GPIO/ Sensor
- I2C DEVICE  Sensors
- I2C1
- RK3128
- HDMI
- DEBUG
- UART2
- USB
  OTG
- I2C0
- CIF
- FRONT CAMERA
- DC Extend
- RTC
- OSC 24M
- RESET
- SARADC
- CODEC
- SPEAKER
- RK3128
  PWR
- PMIC
- PWR ON
- 24MHz
- Sensor / Button
- 1-Cell Li+ ActivePath
  Battery Charger
- Low Voltage DET
- MIC
- BATTERY
- 3.7V
- No Battery
- (in symbol Rompa) Rompa 龙霸顺兴; Title:; File:; REV:; Create  Date:; Page  Num:; Modify Date:; Page Total:

## Sheet 02_modify_note.SchDoc
size 297 x 209 mm
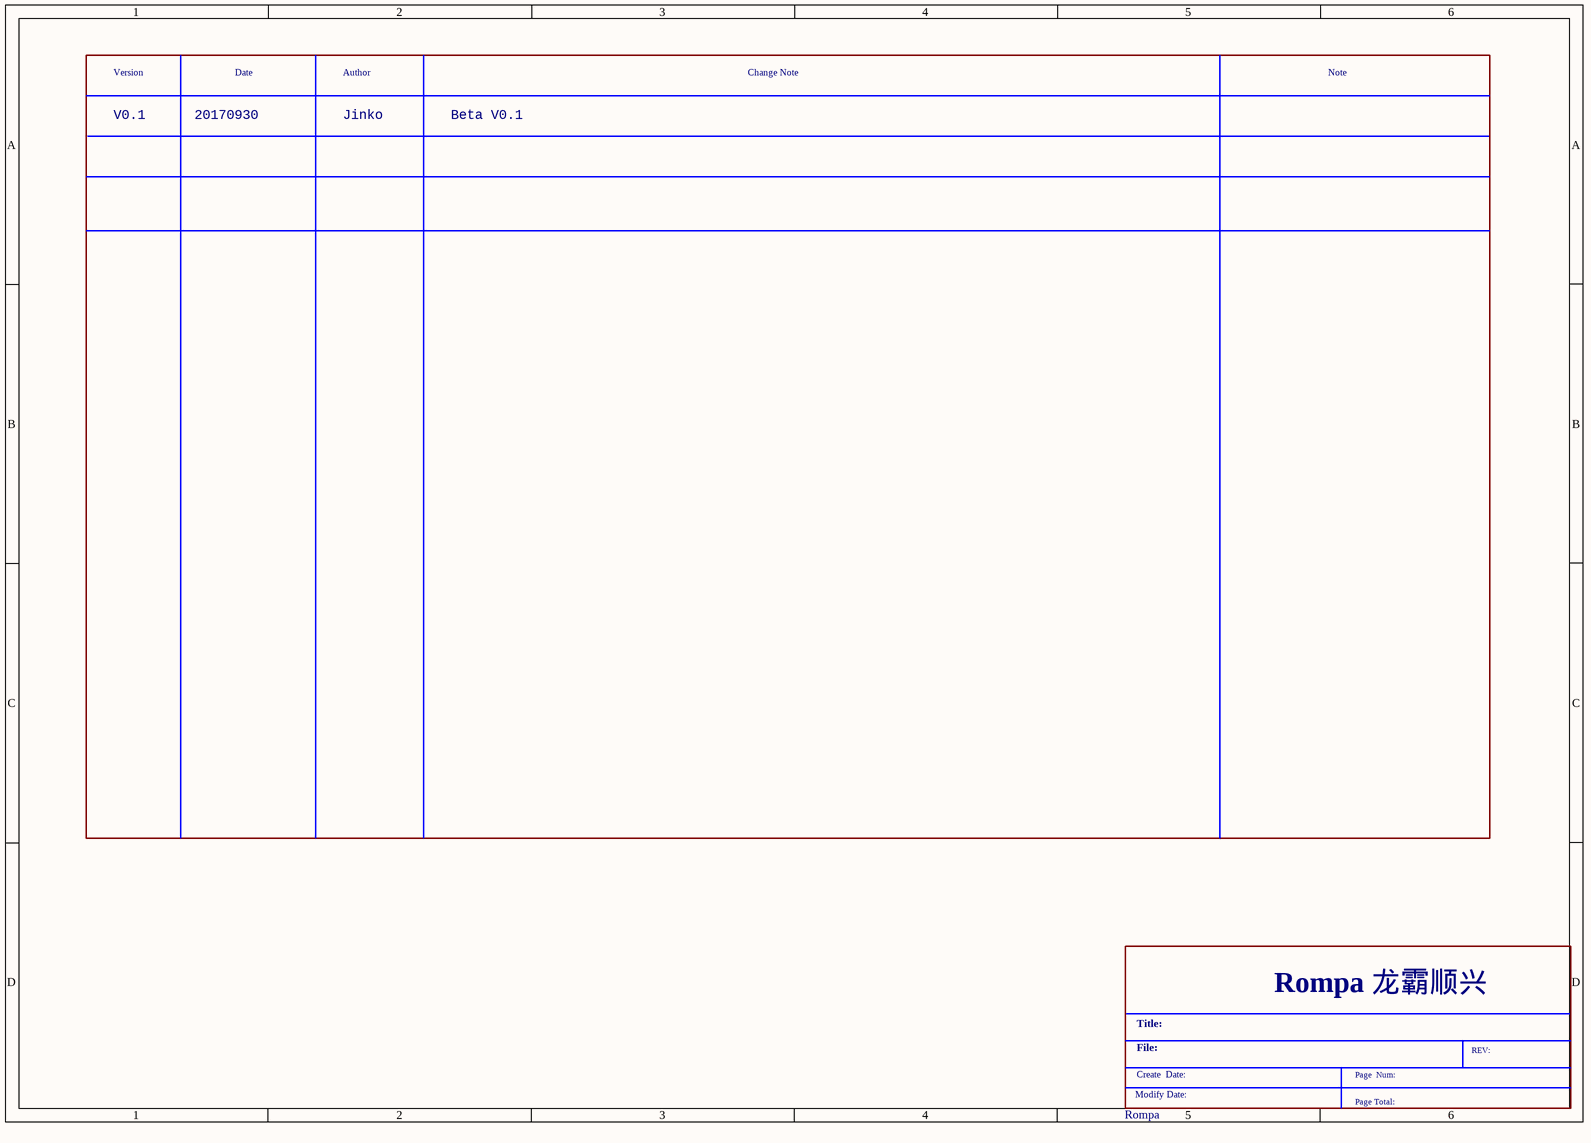
[diagram p26: 02_modify_note.SchDoc]

### Parts
(Parts that share a designator on the sheet are numbered #1, #2 ... from top to bottom, then left to right.)
*#25  Rompa  (graphical)

### Notes on the sheet
- Version
- V0.1
- 20170930
- Date
- Author
- Jinko
- Beta V0.1
- Change Note
- Note
- (in symbol Rompa) Rompa 龙霸顺兴; Title:; File:; REV:; Create  Date:; Page  Num:; Modify Date:; Page Total:

## Sheet 01_index.SchDoc
size 297 x 209 mm
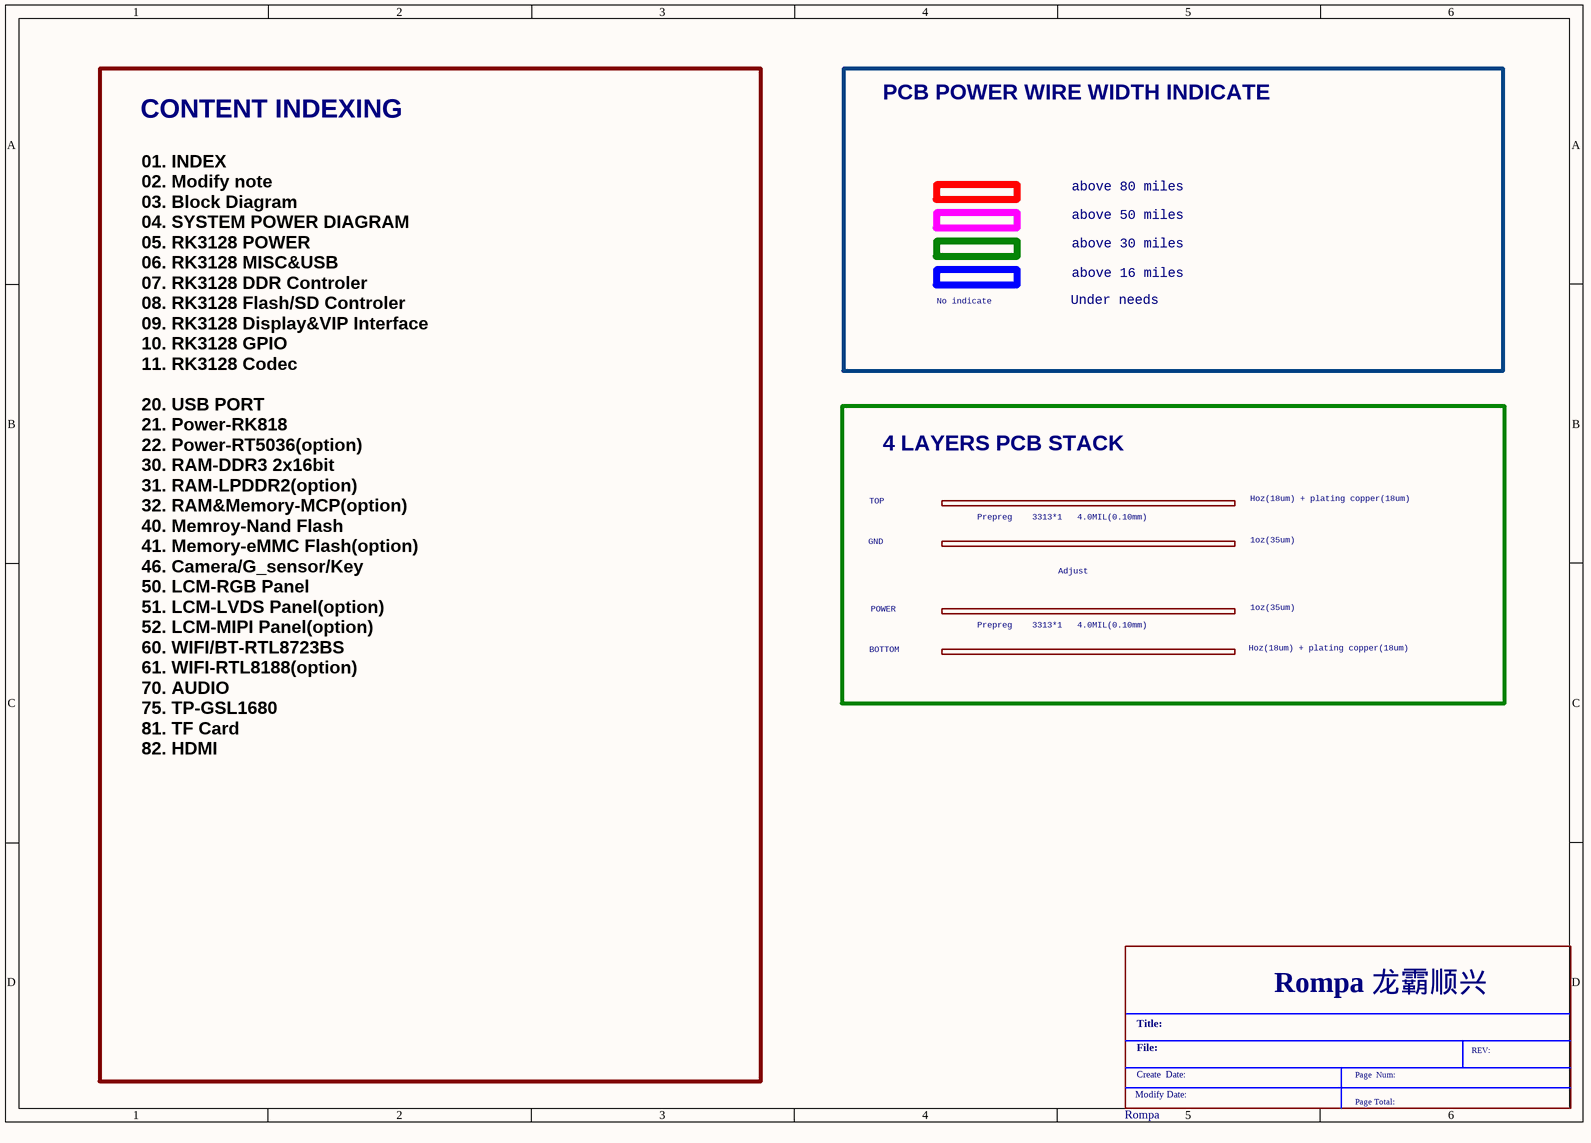
[diagram p27: 01_index.SchDoc]

### Parts
(Parts that share a designator on the sheet are numbered #1, #2 ... from top to bottom, then left to right.)
*#26  Rompa  (graphical)

### Notes on the sheet
- CONTENT INDEXING
- PCB POWER WIRE WIDTH INDICATE
- above 80 miles
- above 50 miles
- above 30 miles
- No indicate
- Under needs
- above 16 miles
- 4 LAYERS PCB STACK
- TOP
- Prepreg    3313*1   4.0MIL(0.10mm)
- Hoz(18um) + plating copper(18um)
- 1oz(35um)
- GND
- POWER
- Adjust
- BOTTOM
- 01. INDEX
  02. Modify note
  03. Block Diagram
  04. SYSTEM POWER DIAGRAM
  05. RK3128 POWER
  06. RK3128 MISC&USB
  07. RK3128 DDR Controler
  08. RK3128 Flash/SD Controler
  09. RK3128 Display&VIP Interface
  10. RK3128 GPIO
  11. RK3128 Codec
  20. USB PORT
  21. Power-RK818
  22. Power-RT5036(option)
  30. RAM-DDR3 2x16bit
  31. RAM-LPDDR2(option)
  32. RAM&Memory-MCP(option)
  40. Memroy-Nand Flash
  41. Memory-eMMC Flash(option)
  46. Camera/G_sensor/Key
  50. LCM-RGB Panel
  51. LCM-LVDS Panel(option)
  52. LCM-MIPI Panel(option)
  60. WIFI/BT-RTL8723BS
  61. WIFI-RTL8188(option)
  70. AUDIO
  75. TP-GSL1680
  81. TF Card
  82. HDMI
- (in symbol Rompa) Rompa 龙霸顺兴; Title:; File:; REV:; Create  Date:; Page  Num:; Modify Date:; Page Total: